# Altium schematic sheet HU_revC.SchDoc
size E; SheetNumber: 1; SheetTotal: 20
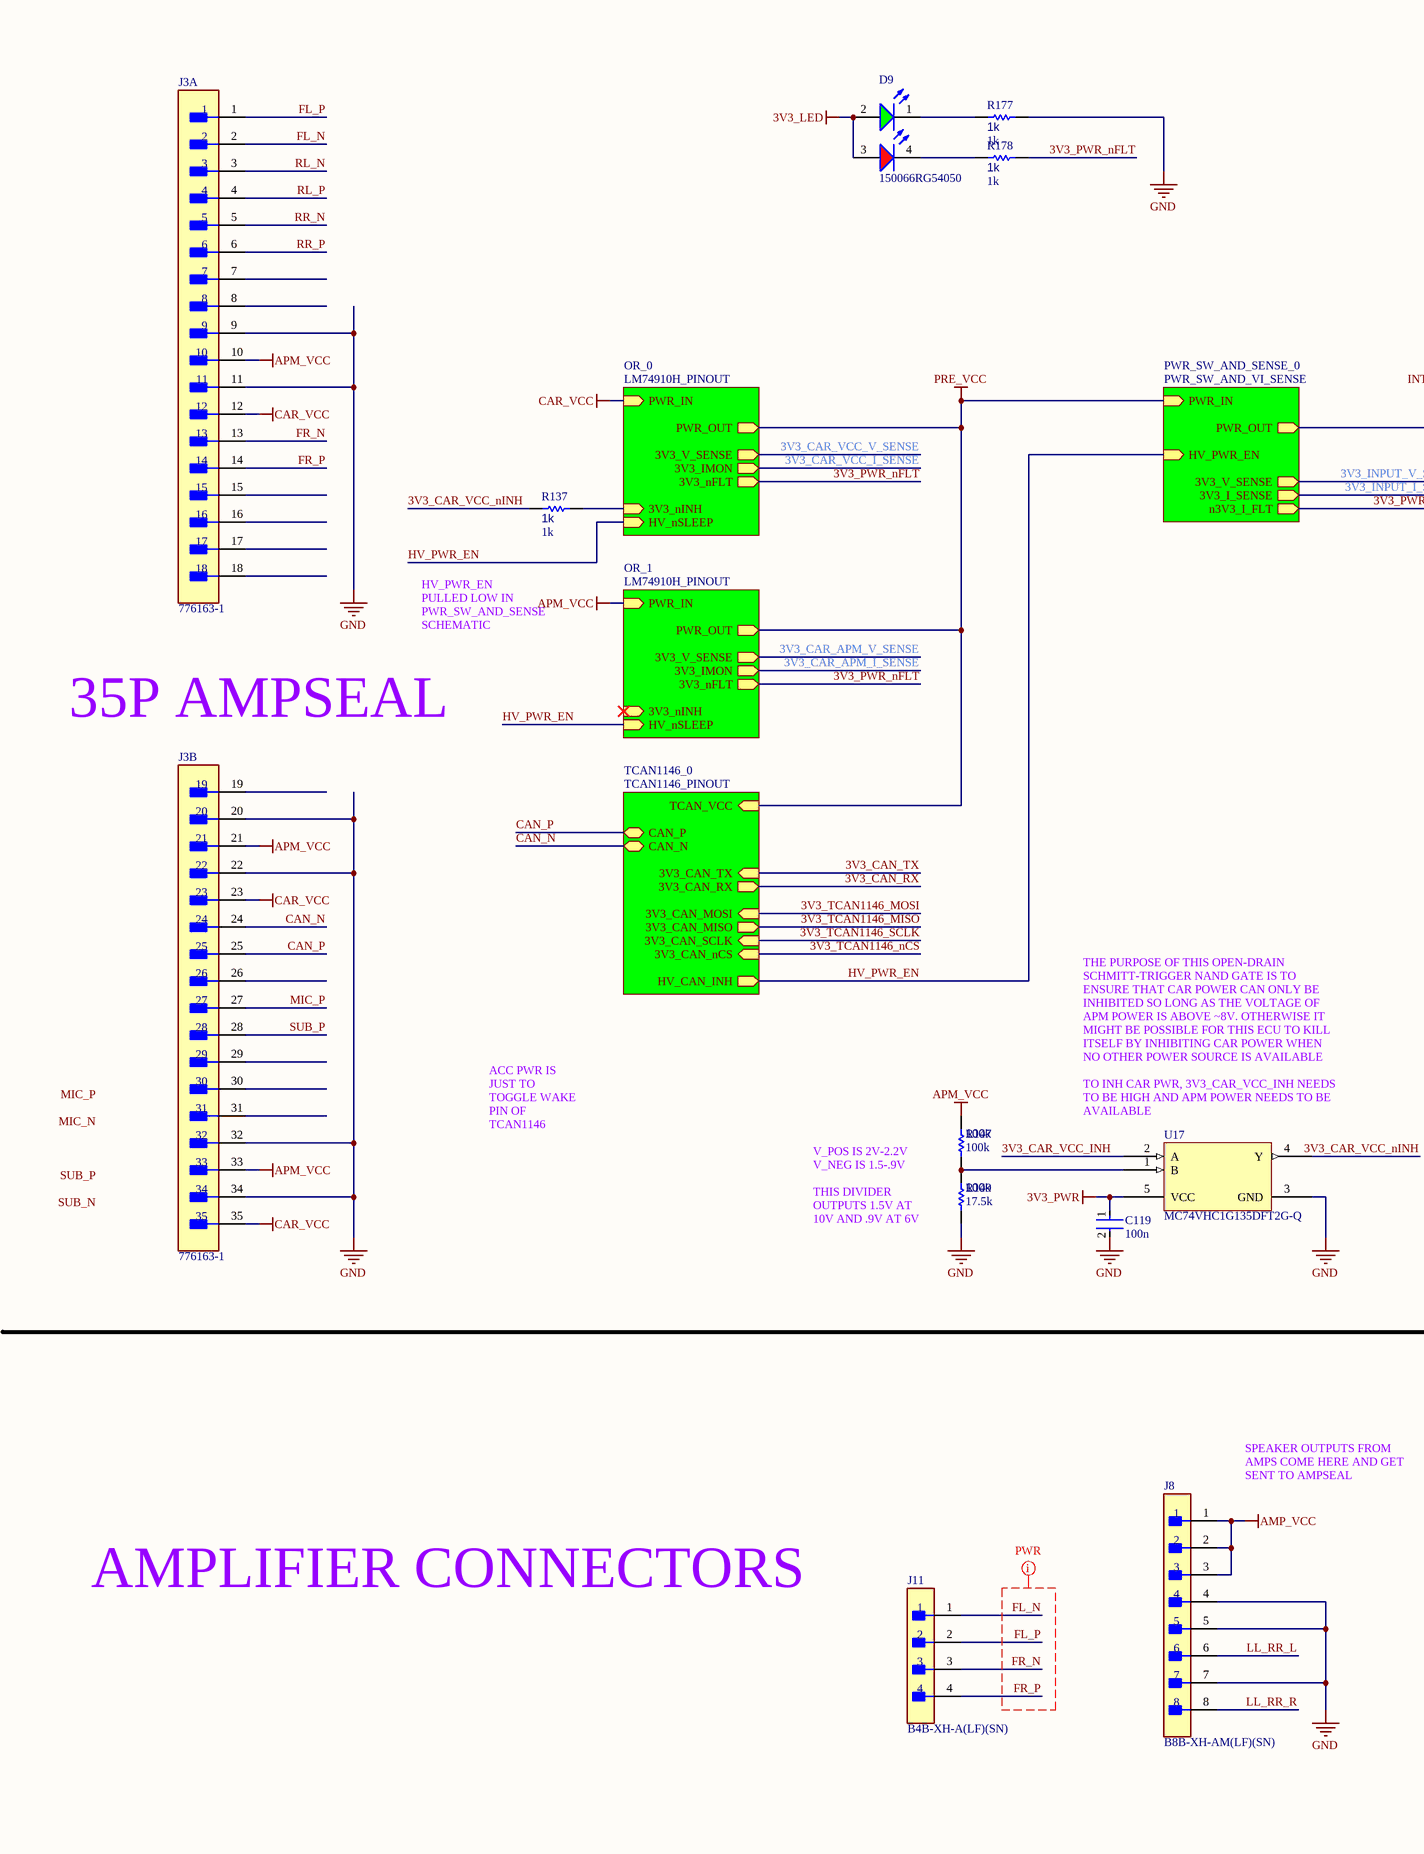
[diagram p0: HU_revC.SchDoc, top left]
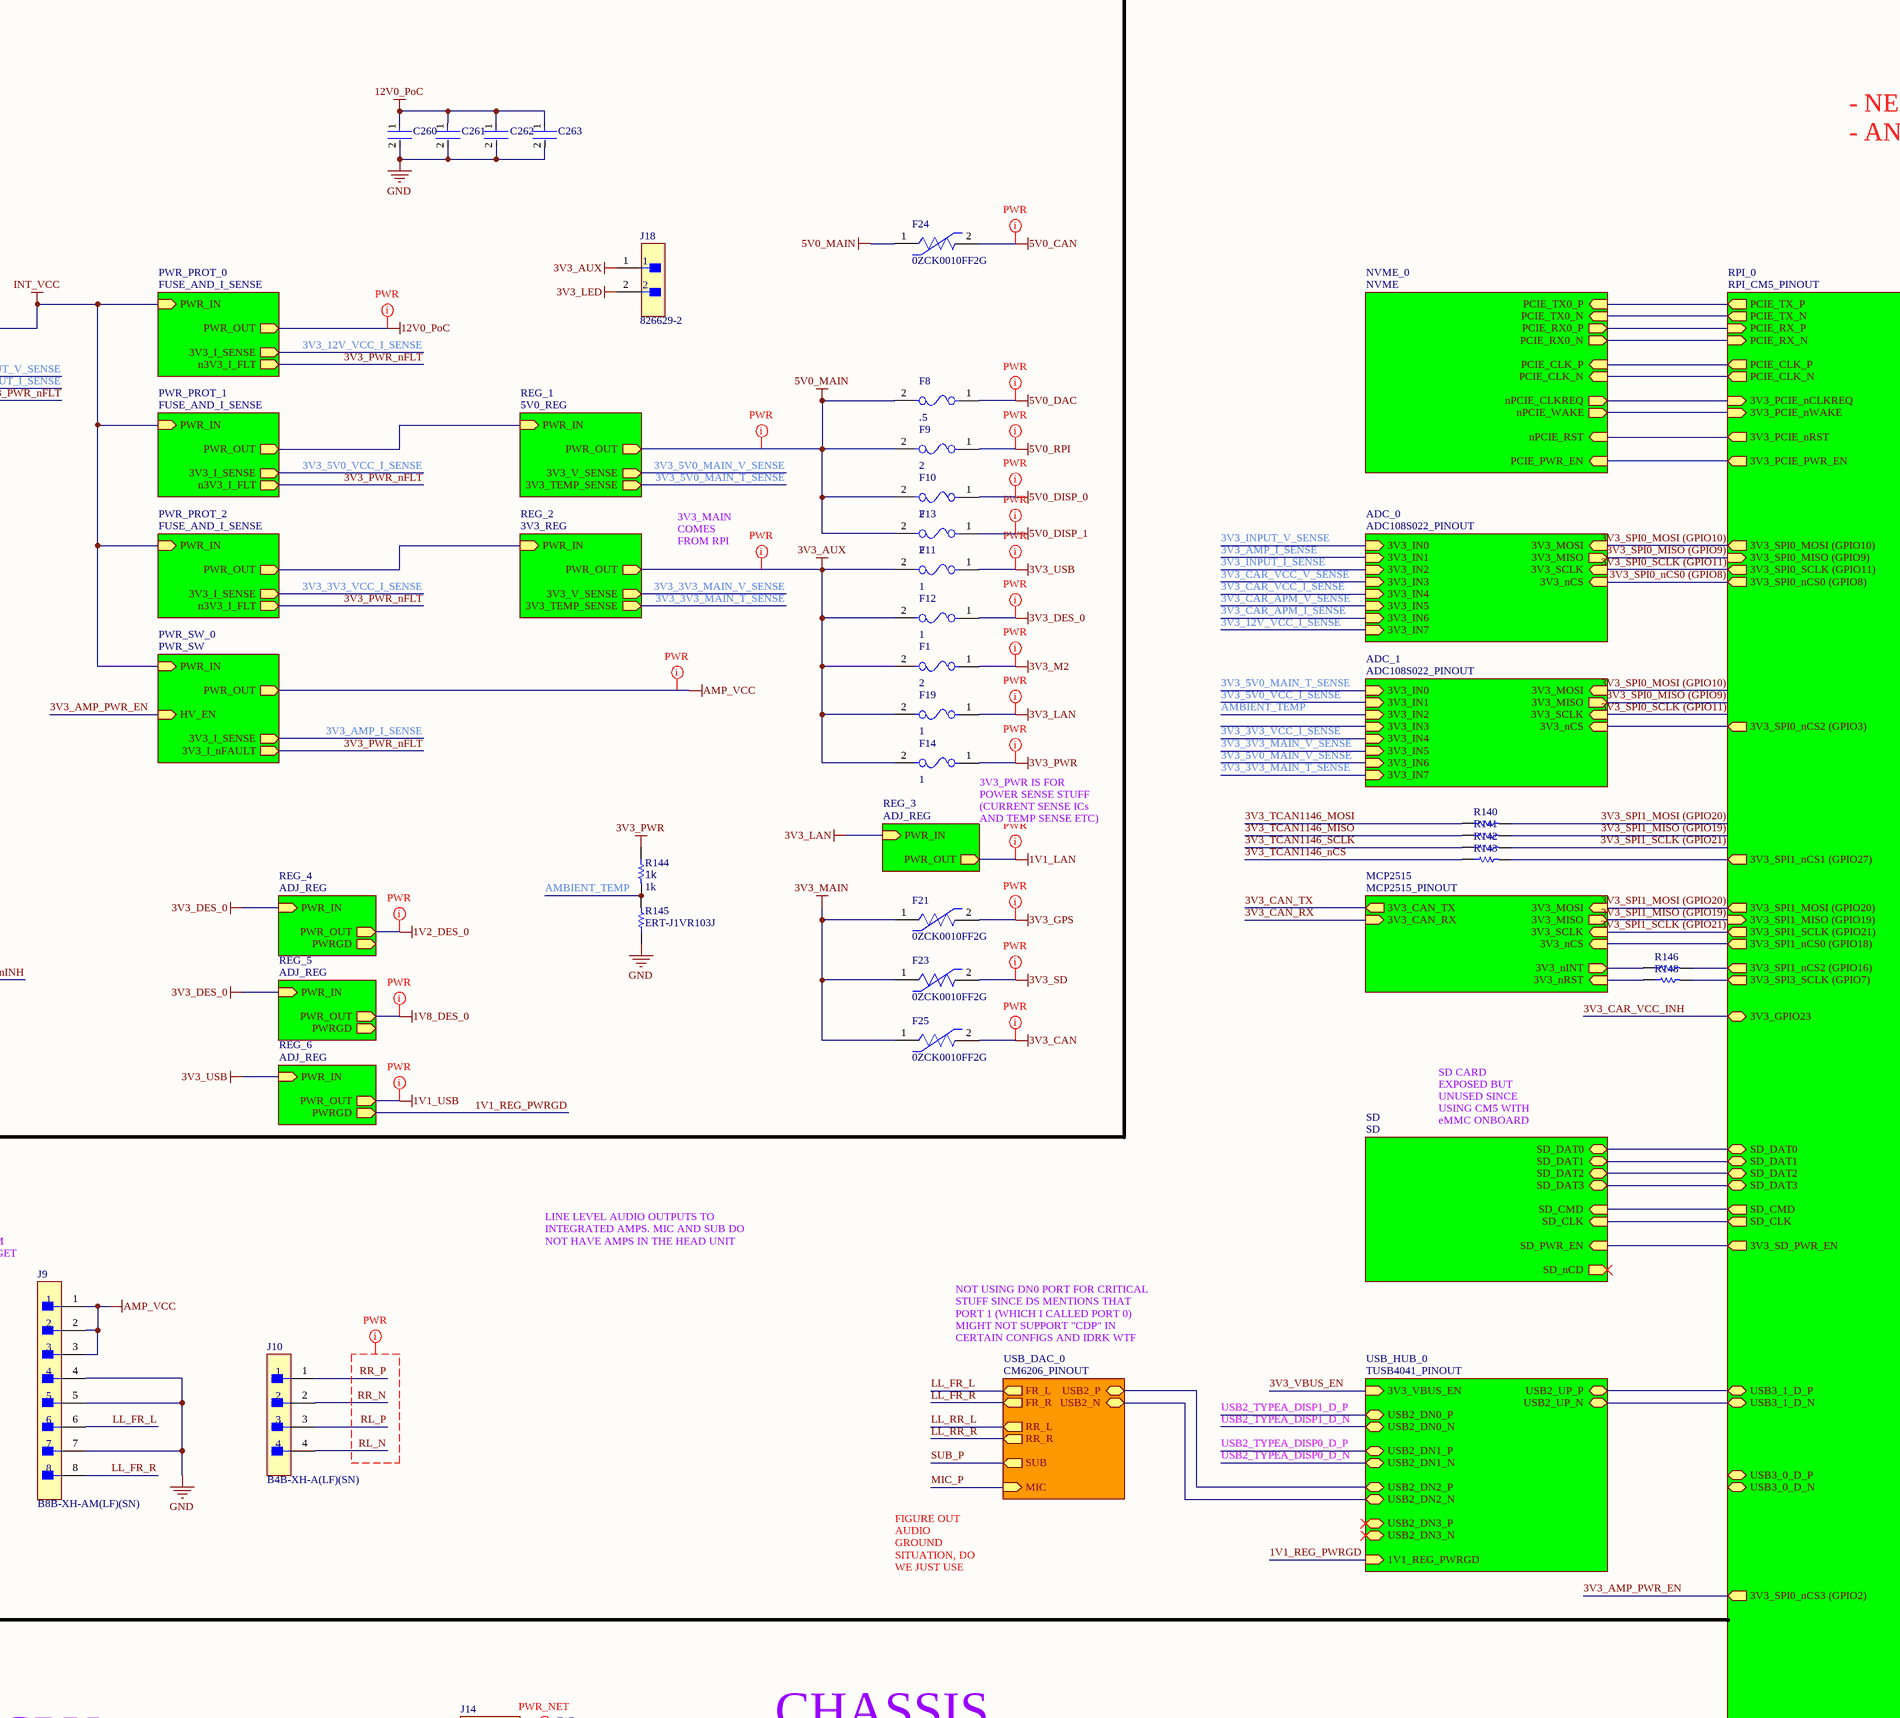
[diagram p1: HU_revC.SchDoc, top middle]
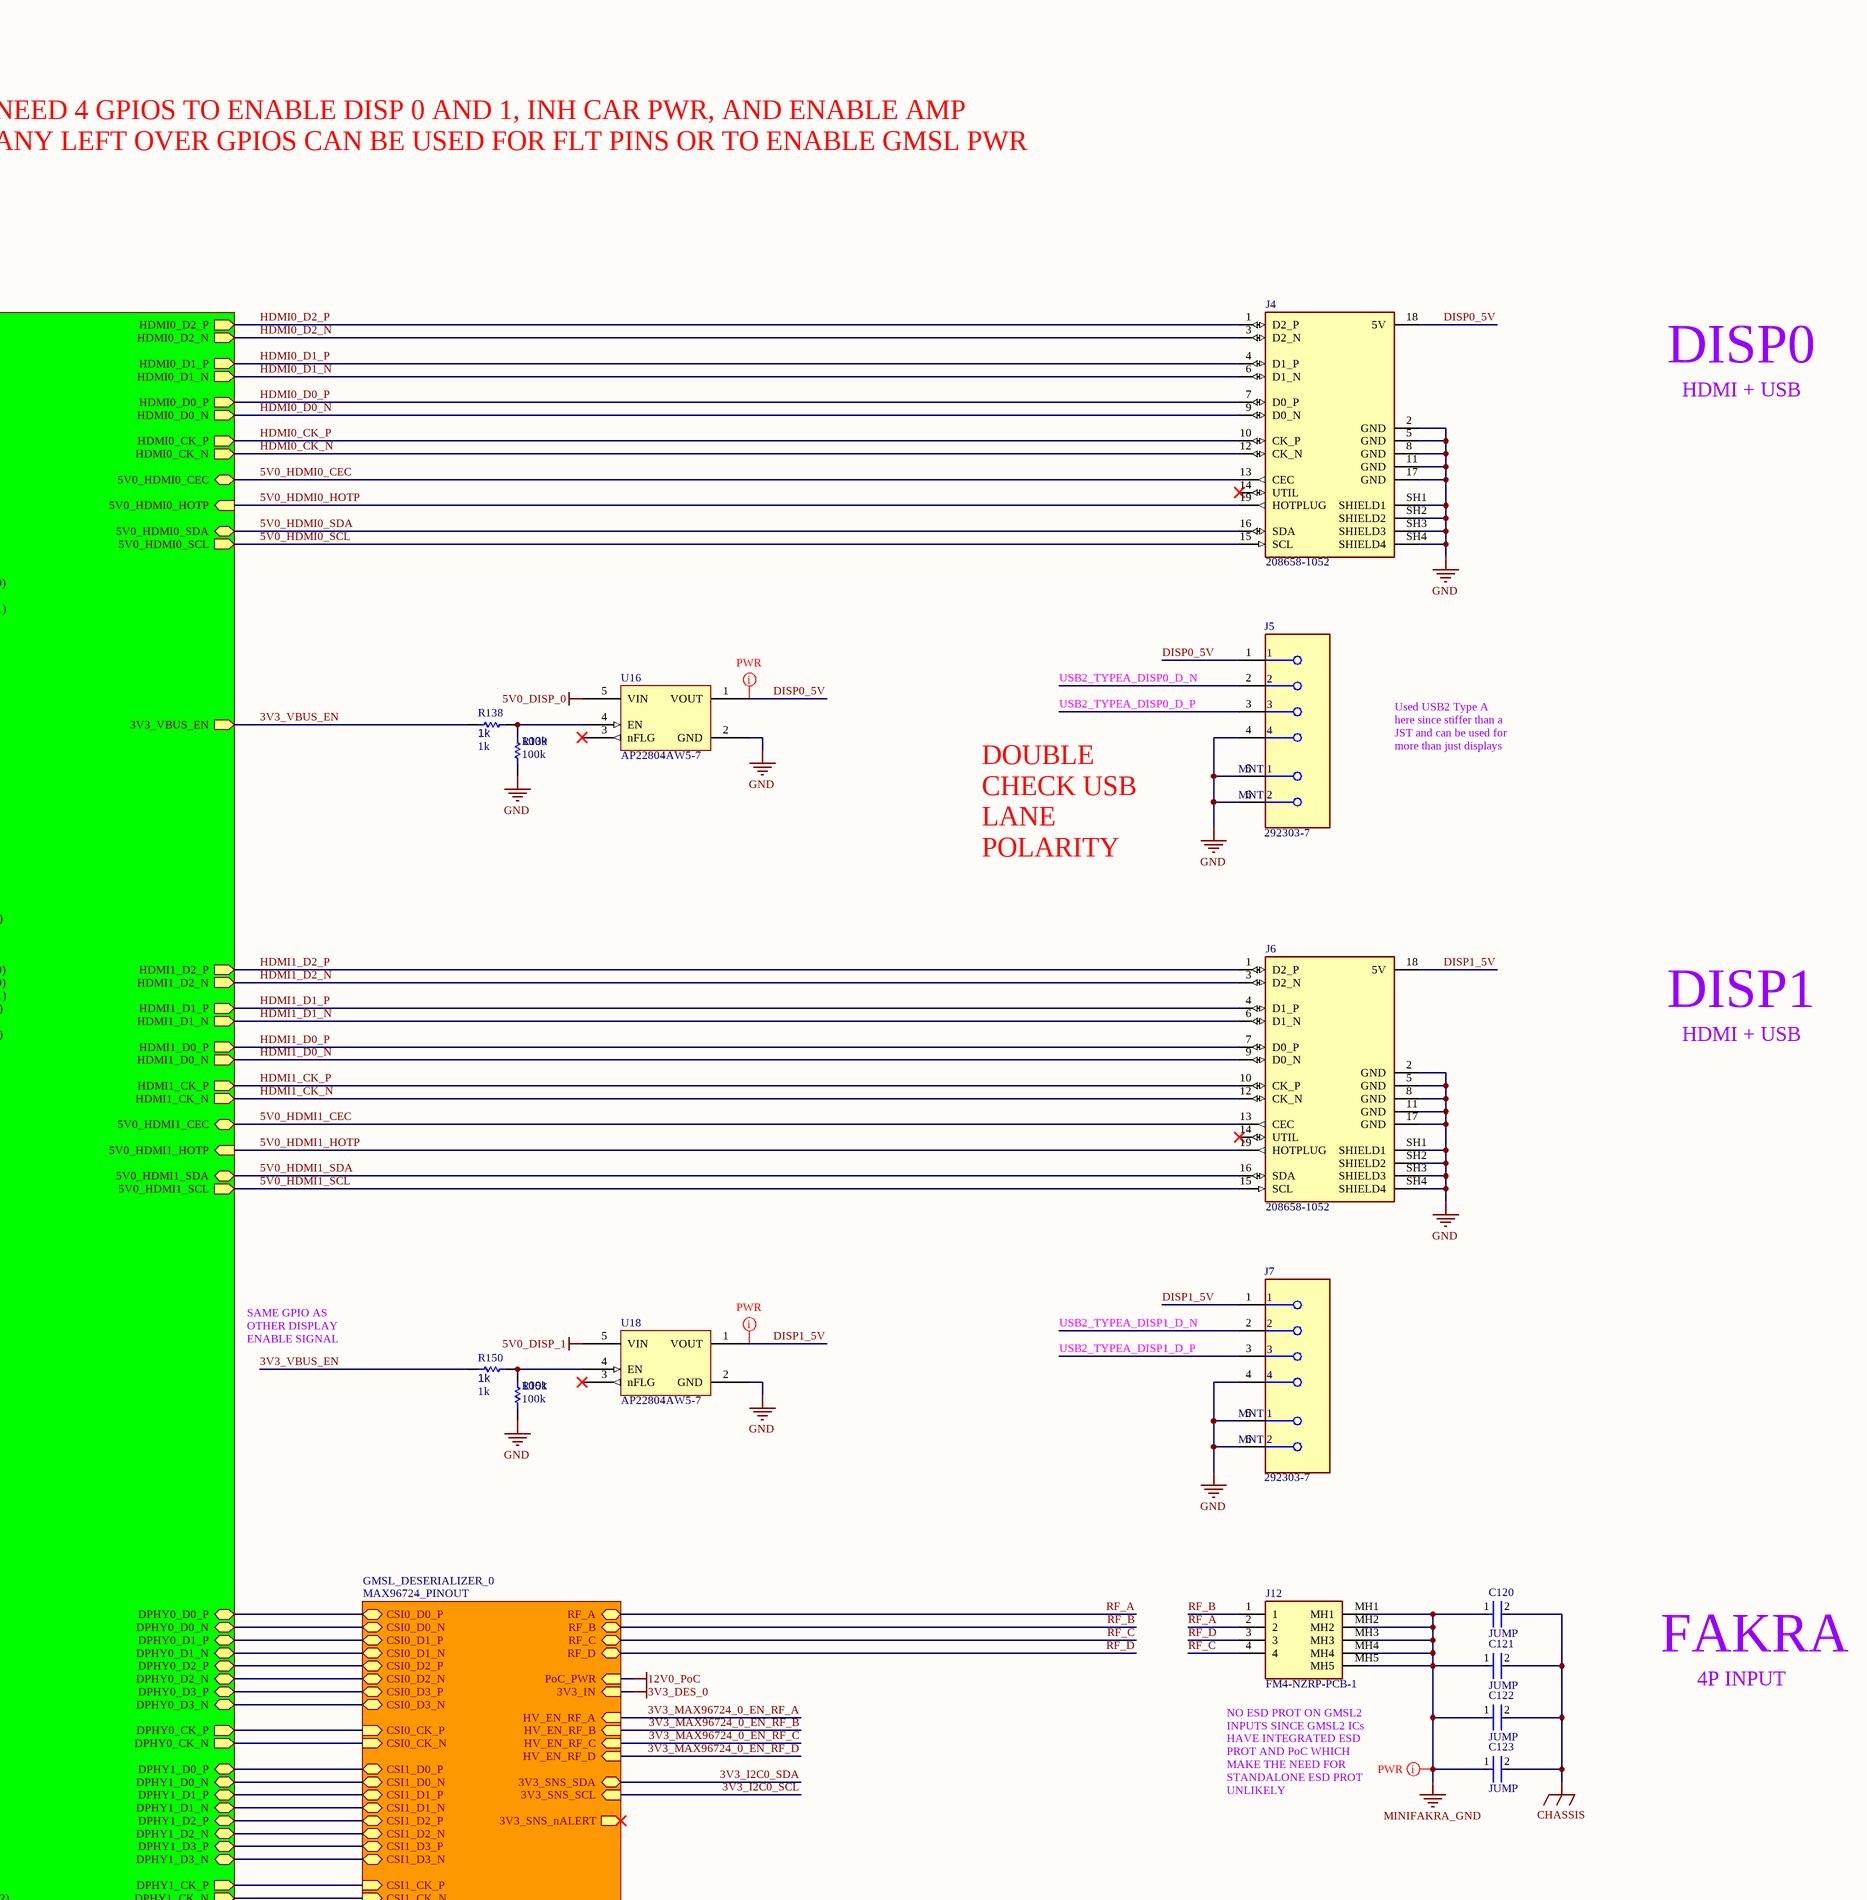
[diagram p2: HU_revC.SchDoc, top right]
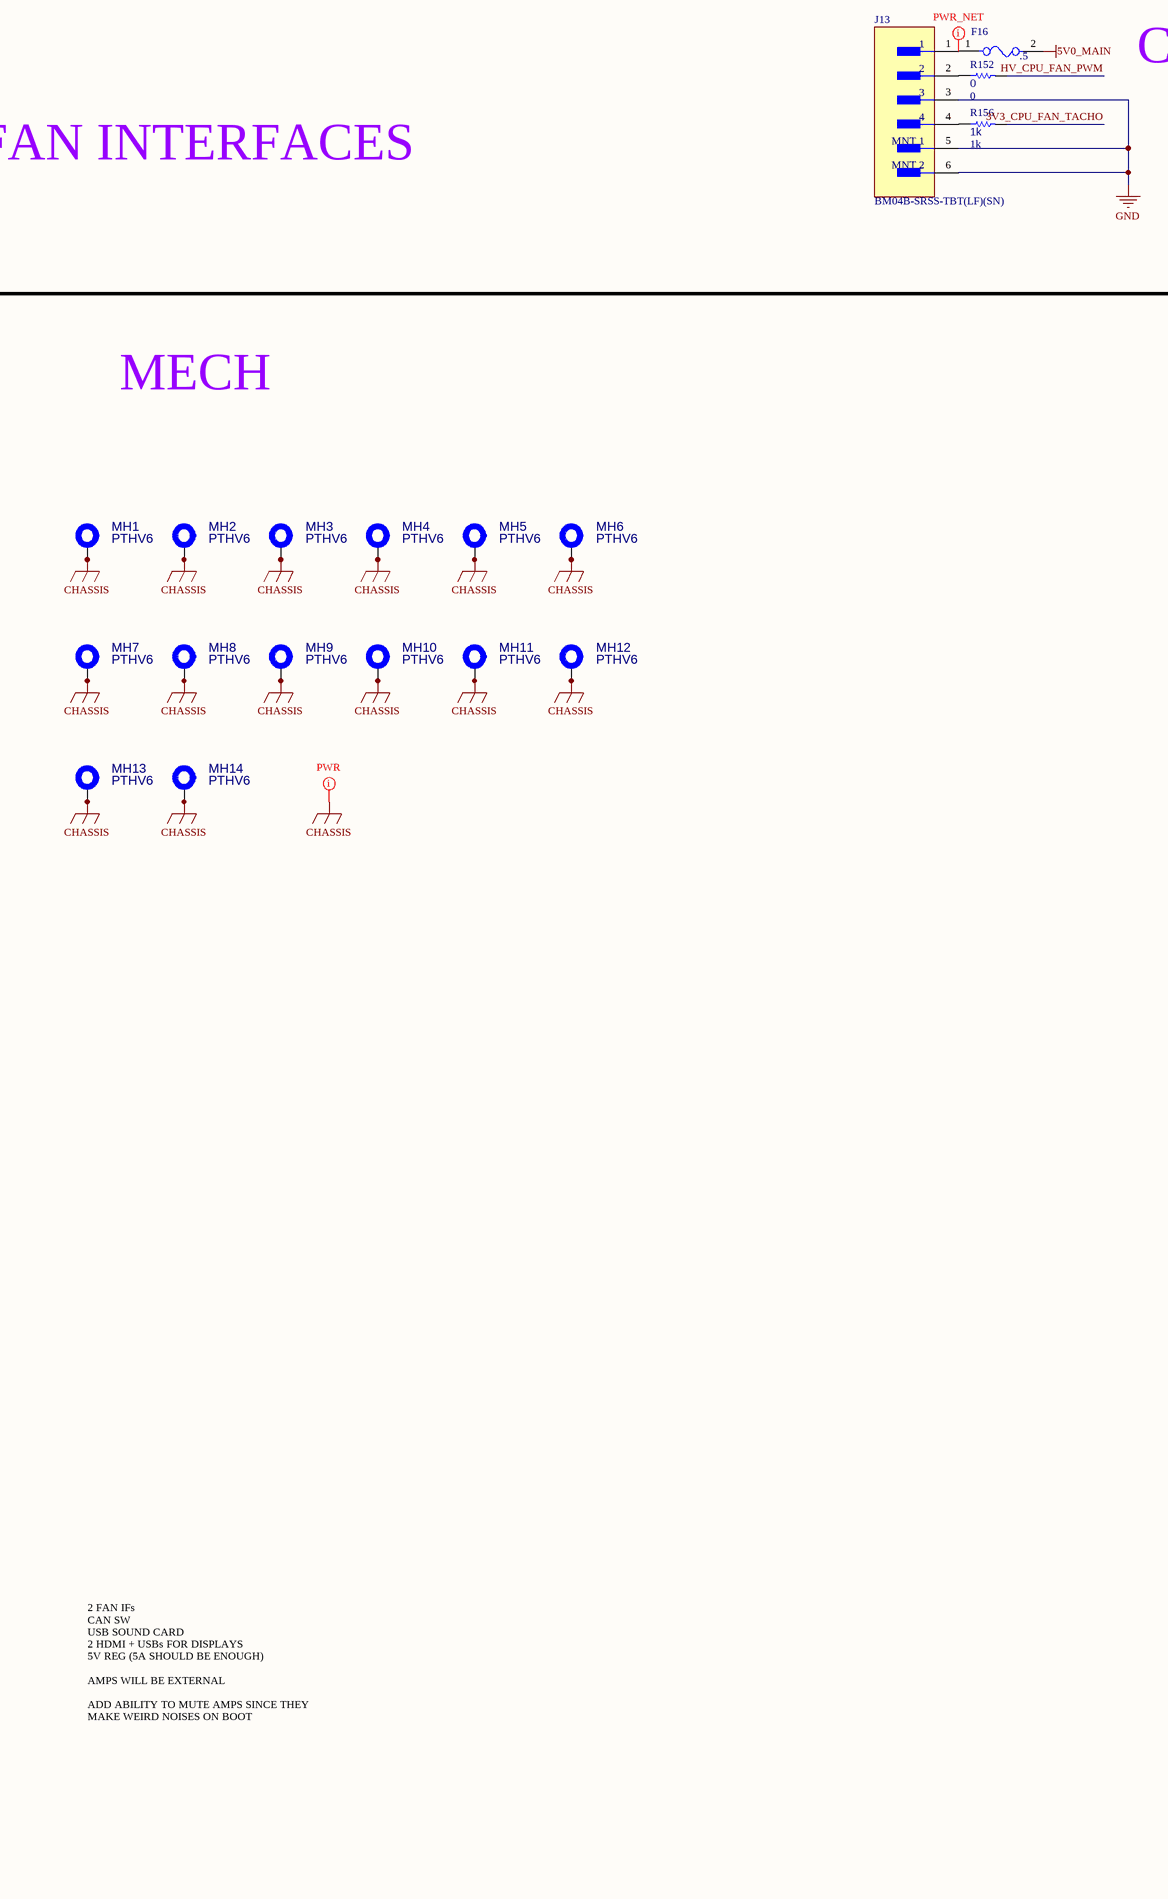
[diagram p3: HU_revC.SchDoc, bottom left]
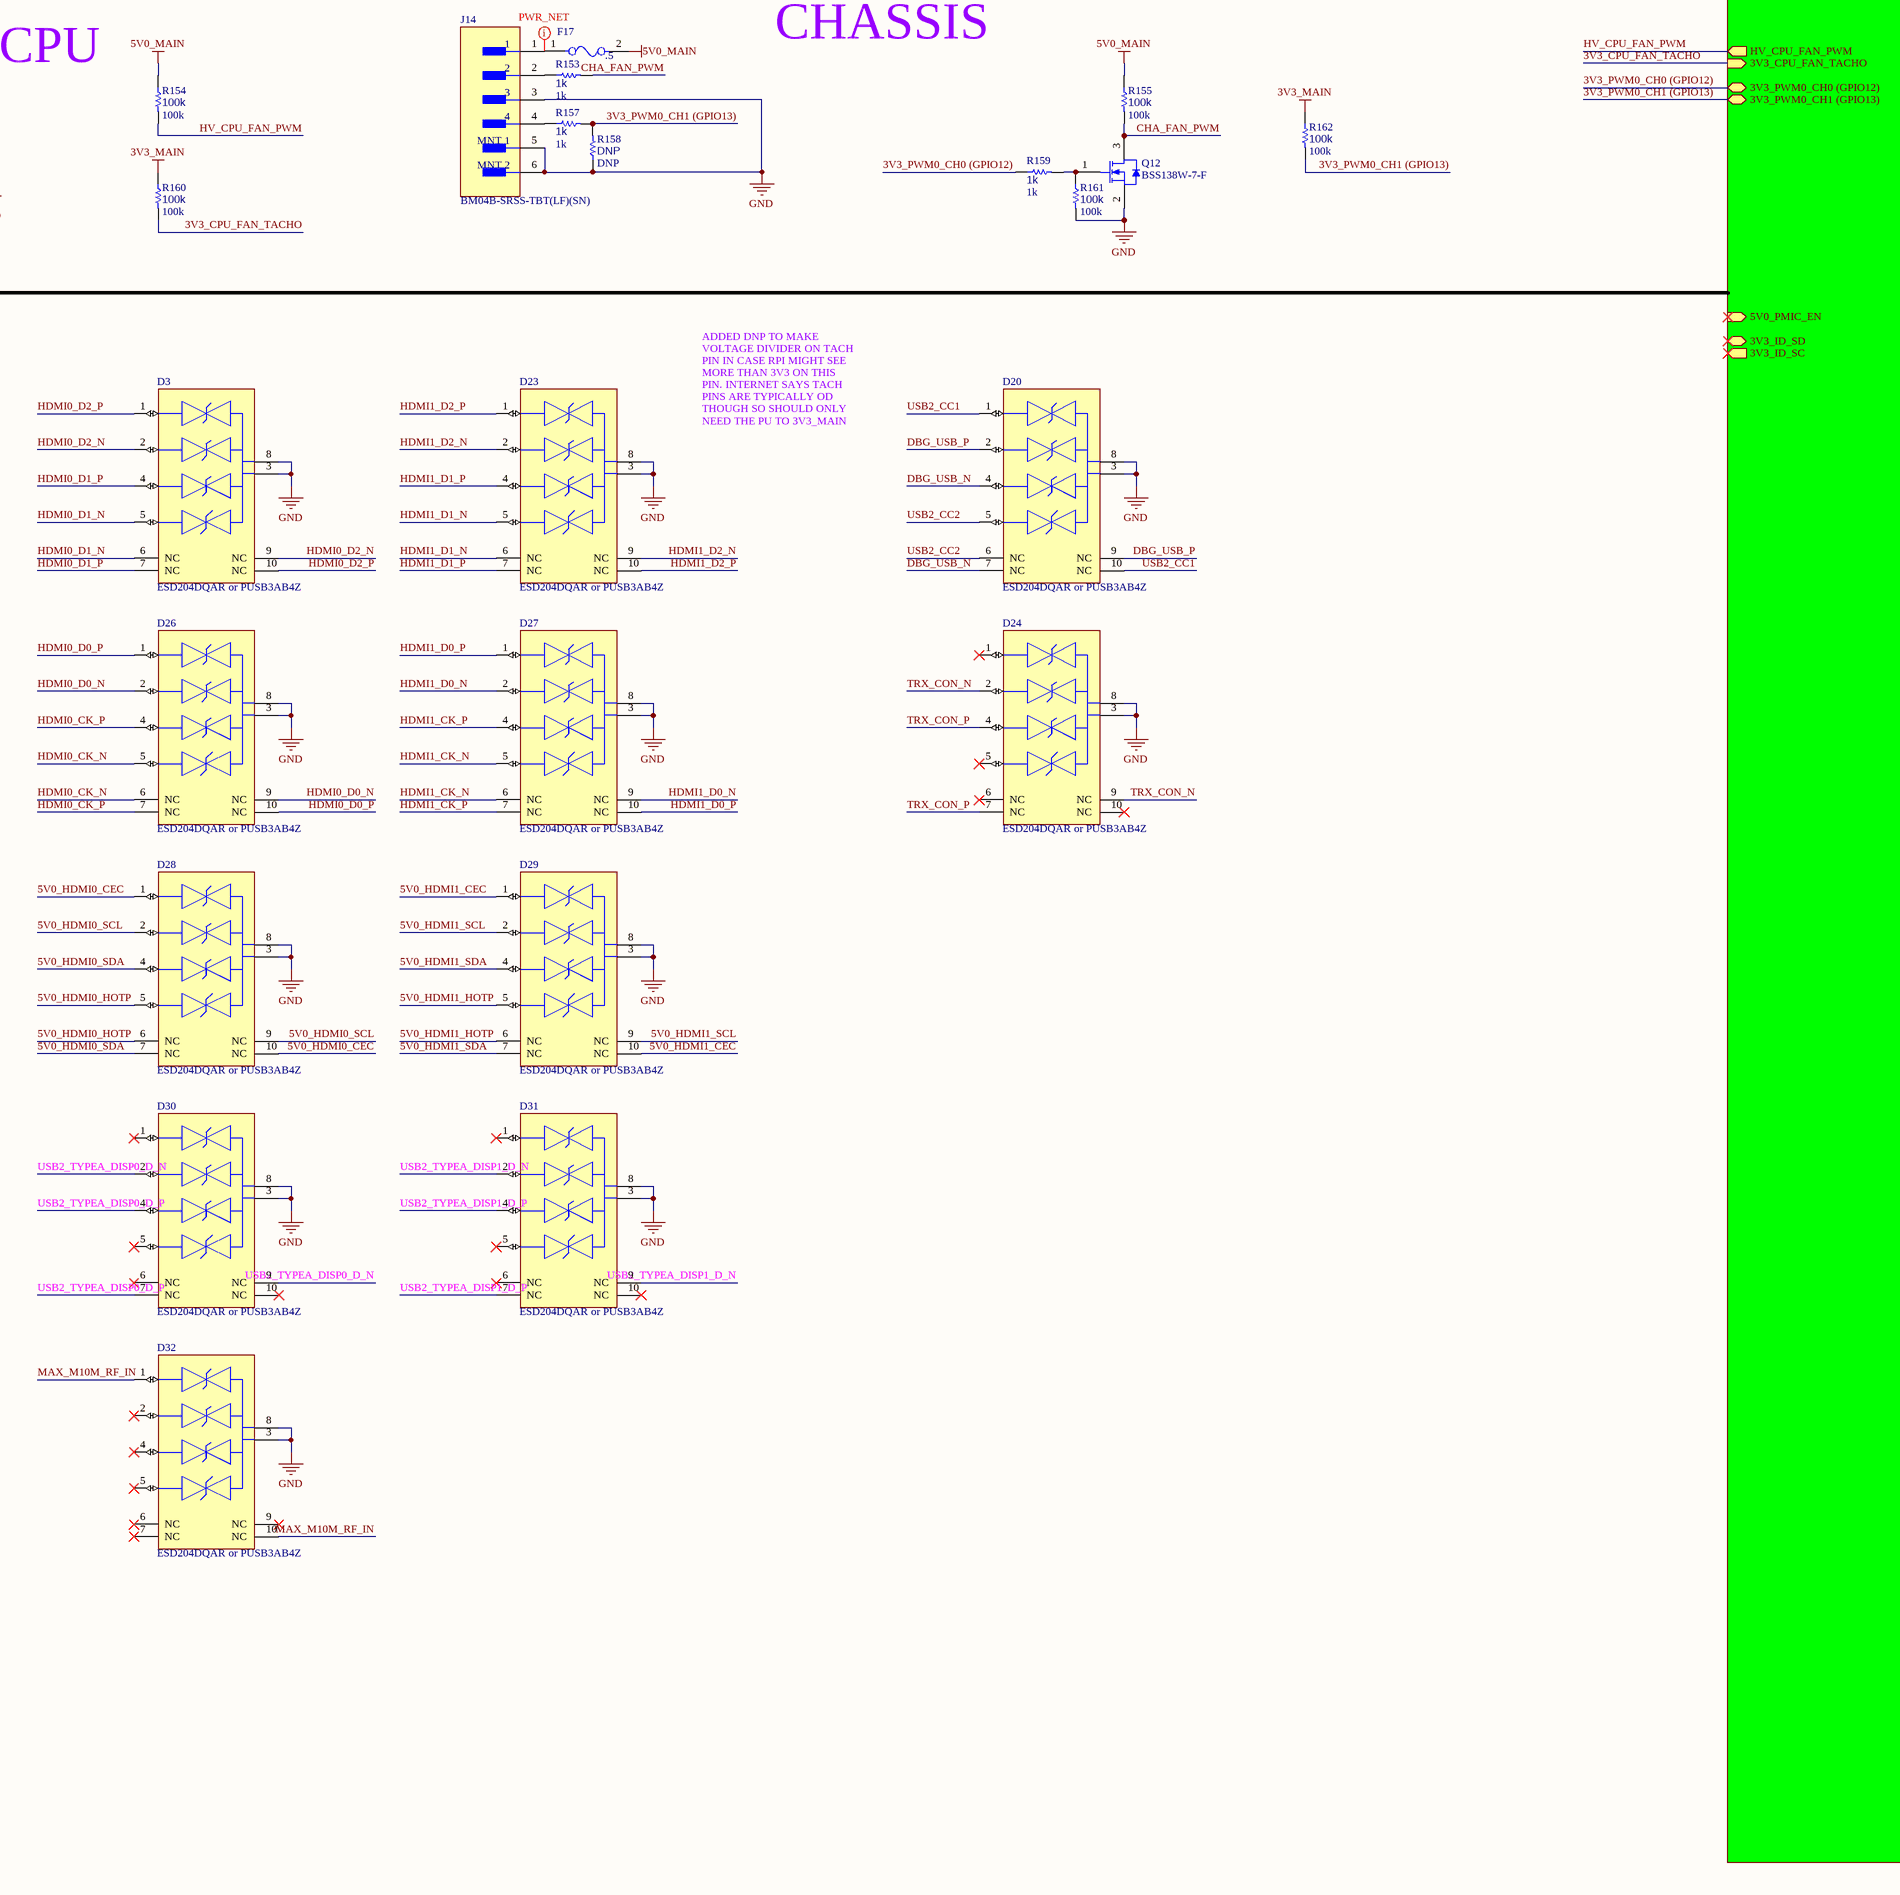
[diagram p4: HU_revC.SchDoc, bottom middle]
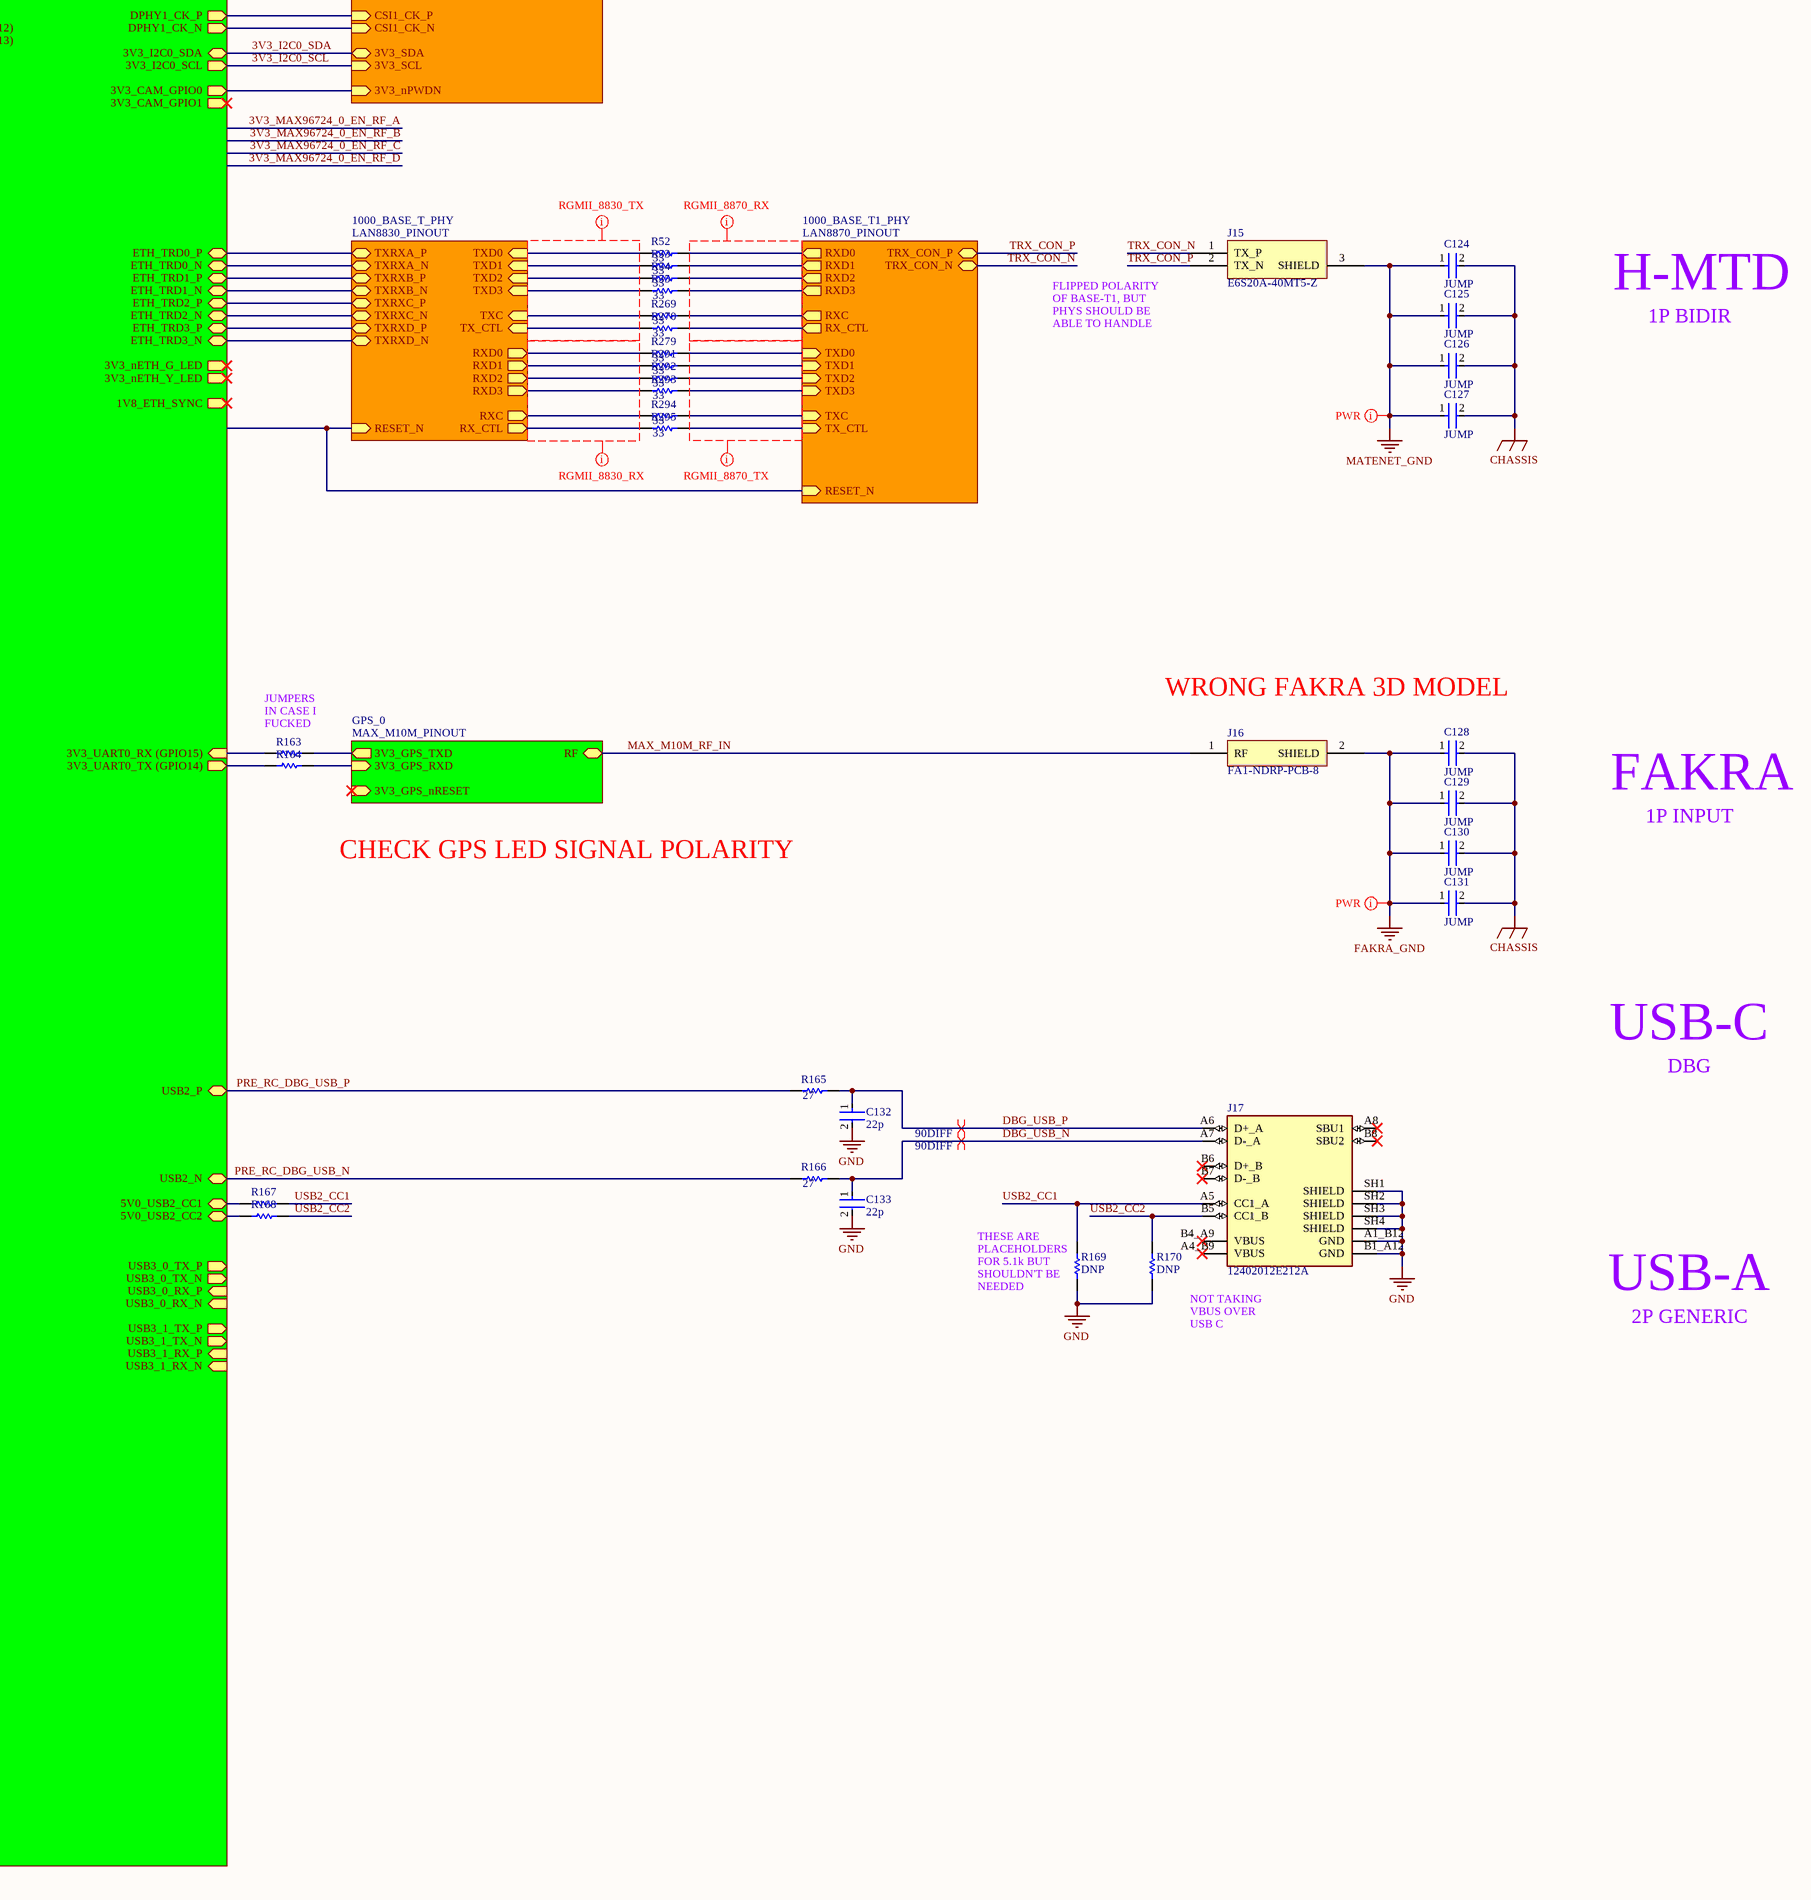
[diagram p5: HU_revC.SchDoc, bottom right]

## Parts
C119  100n  [FP-0402-L_1_0_0_05-W_0_5-IPC_A]
C120  JUMP  [FP-0402-L_1_0_0_05-W_0_5-IPC_A]
C121  JUMP  [FP-0402-L_1_0_0_05-W_0_5-IPC_A]
C122  JUMP  [FP-0402-L_1_0_0_05-W_0_5-IPC_A]
C123  JUMP  [FP-0402-L_1_0_0_05-W_0_5-IPC_A]
C124  JUMP  [FP-0402-L_1_0_0_05-W_0_5-IPC_A]
C125  JUMP  [FP-0402-L_1_0_0_05-W_0_5-IPC_A]
C126  JUMP  [FP-0402-L_1_0_0_05-W_0_5-IPC_A]
C127  JUMP  [FP-0402-L_1_0_0_05-W_0_5-IPC_A]
C128  JUMP  [FP-0402-L_1_0_0_05-W_0_5-IPC_A]
C129  JUMP  [FP-0402-L_1_0_0_05-W_0_5-IPC_A]
C130  JUMP  [FP-0402-L_1_0_0_05-W_0_5-IPC_A]
C131  JUMP  [FP-0402-L_1_0_0_05-W_0_5-IPC_A]
C132  22p  [FP-0402-L_1_0_0_05-W_0_5-IPC_A]
C133  22p  [FP-0402-L_1_0_0_05-W_0_5-IPC_A]
C260  GRM32ER61C476KE15L  [FP-GRM32E-0_3-0_2-IPC_C]  (value not drawn)
C261  GRM32ER61C476KE15L  [FP-GRM32E-0_3-0_2-IPC_C]  (value not drawn)
C262  GRM32ER61C476KE15L  [FP-GRM32E-0_3-0_2-IPC_C]  (value not drawn)
C263  GRM32ER61C476KE15L  [FP-GRM32E-0_3-0_2-IPC_C]  (value not drawn)
D3  ESD204DQAR or PUSB3AB4Z  [FP-DQA0010A-MFG]
D9  150066RG54050  [WL-SBCD_0606]
D20  ESD204DQAR or PUSB3AB4Z  [FP-DQA0010A-MFG]
D23  ESD204DQAR or PUSB3AB4Z  [FP-DQA0010A-MFG]
D24  ESD204DQAR or PUSB3AB4Z  [FP-DQA0010A-MFG]
D26  ESD204DQAR or PUSB3AB4Z  [FP-DQA0010A-MFG]
D27  ESD204DQAR or PUSB3AB4Z  [FP-DQA0010A-MFG]
D28  ESD204DQAR or PUSB3AB4Z  [FP-DQA0010A-MFG]
D29  ESD204DQAR or PUSB3AB4Z  [FP-DQA0010A-MFG]
D30  ESD204DQAR or PUSB3AB4Z  [FP-DQA0010A-MFG]
D31  ESD204DQAR or PUSB3AB4Z  [FP-DQA0010A-MFG]
D32  ESD204DQAR or PUSB3AB4Z  [FP-DQA0010A-MFG]
F1  2  [FP-0685T-MFG]
F8  .5  [FP-0685T-MFG]
F9  2  [FP-0685T-MFG]
F10  2  [FP-0685T-MFG]
F11  1  [FP-0685T-MFG]
F12  1  [FP-0685T-MFG]
F13  2  [FP-0685T-MFG]
F14  1  [FP-0685T-MFG]
F16  .5  [FP-0685T-MFG]
F17  .5  [FP-0685T-MFG]
F19  1  [FP-0685T-MFG]
F21  0ZCK0010FF2G  [FP-0ZCK0010FF2G-MFG]
F23  0ZCK0010FF2G  [FP-0ZCK0010FF2G-MFG]
F24  0ZCK0010FF2G  [FP-0ZCK0010FF2G-MFG]
F25  0ZCK0010FF2G  [FP-0ZCK0010FF2G-MFG]
J3  776163-1  [FP-776163-1-MFG]  (parts A,B of 2)
J4  208658-1052  [208658-1052-Footprint-1]
J5  292303-7  [FP-292303-7-MFG]
J6  208658-1052  [208658-1052-Footprint-1]
J7  292303-7  [FP-292303-7-MFG]
J8  B8B-XH-AM(LF)(SN)  [FP-B8B-XH-AM_LF_SN-MFG]
J9  B8B-XH-AM(LF)(SN)  [FP-B8B-XH-AM_LF_SN-MFG]
J10  B4B-XH-A(LF)(SN)  [FP-B4B-XH-A_LF_SN-MFG]
J11  B4B-XH-A(LF)(SN)  [FP-B4B-XH-A_LF_SN-MFG]
J12  FM4-NZRP-PCB-1  [FM4-NZRP-PCB-1-Footprint-1]
J13  BM04B-SRSS-TBT(LF)(SN)  [FP-BM04B-SRSS-TBT_LF_SN-MFG]
J14  BM04B-SRSS-TBT(LF)(SN)  [FP-BM04B-SRSS-TBT_LF_SN-MFG]
J15  E6S20A-40MT5-Z  [E6S20A-40MT5-Z-Footprint-1]
J16  FA1-NDRP-PCB-8  [FA1-NDRP-PCB-8-Footprint-1]
J17  12402012E212A  [12402012E212A-Footprint-1]
J18  826629-2  [FP-826629-2-MFG]
MH1  PTHV6  [PTHV6 M2]  (net tie, no BOM)
MH2  PTHV6  [PTHV6 M2]  (net tie, no BOM)
MH3  PTHV6  [PTHV6 M2]  (net tie, no BOM)
MH4  PTHV6  [PTHV6 M2]  (net tie, no BOM)
MH5  PTHV6  [PTHV6 M2]  (net tie, no BOM)
MH6  PTHV6  [PTHV6 M2]  (net tie, no BOM)
MH7  PTHV6  [PTHV6 M2]  (net tie, no BOM)
MH8  PTHV6  [PTHV6 M2]  (net tie, no BOM)
MH9  PTHV6  [PTHV6 M2]  (net tie, no BOM)
MH10  PTHV6  [PTHV6 M2]  (net tie, no BOM)
MH11  PTHV6  [PTHV6 M2]  (net tie, no BOM)
MH12  PTHV6  [PTHV6 M2]  (net tie, no BOM)
MH13  PTHV6  [PTHV6 M2]  (net tie, no BOM)
MH14  PTHV6  [PTHV6 M2]  (net tie, no BOM)
Q12  BSS138W-7-F  [DIOD-SOT323-3_V]
R52  33  [R0603B]
R53  33  [R0603B]
R54  33  [R0603B]
R55  33  [R0603B]
R137  1k  [R0603B]
R138  1k  [R0603B]
R139  100k  [R0603B]
R140  0402 JUMPER  [RESC1005X40X25ML05T05]  (value not drawn)
R141  0402 JUMPER  [RESC1005X40X25ML05T05]  (value not drawn)
R142  0402 JUMPER  [RESC1005X40X25ML05T05]  (value not drawn)
R143  0402 JUMPER  [RESC1005X40X25ML05T05]  (value not drawn)
R144  1k  [R0603B]
R145  ERT-J1VR103J  [RESC1608X90X30ML15T20]
R146  0402 JUMPER  [RESC1005X40X25ML05T05]  (value not drawn)
R147  100k  [R0603B]
R148  0402 JUMPER  [RESC1005X40X25ML05T05]  (value not drawn)
R149  17.5k  value 100k  [R0603B]
R150  1k  [R0603B]
R151  100k  [R0603B]
R152  0  [R0603B]
R153  1k  [R0603B]
R154  100k  [R0603B]
R155  100k  [R0603B]
R156  1k  [R0603B]
R157  1k  [R0603B]
R158  DNP  [R0603B]
R159  1k  [R0603B]
R160  100k  [R0603B]
R161  100k  [R0603B]
R162  100k  [R0603B]
R163  0402 JUMPER  [RESC1005X40X25ML05T05]  (value not drawn)
R164  0402 JUMPER  [RESC1005X40X25ML05T05]  (value not drawn)
R165  27  [R0603B]
R166  27  [R0603B]
R167  0402 JUMPER  [RESC1005X40X25ML05T05]  (value not drawn)
R168  0402 JUMPER  [RESC1005X40X25ML05T05]  (value not drawn)
R169  DNP  [R0603B]
R170  DNP  [R0603B]
R177  1k  [R0603B]
R178  1k  [R0603B]
R269  33  [R0603B]
R270  33  [R0603B]
R279  33  [R0603B]
R291  33  [R0603B]
R292  33  [R0603B]
R293  33  [R0603B]
R294  33  [R0603B]
R295  33  [R0603B]
U16  AP22804AW5-7  [SOT95P285X140-5N]
U17  MC74VHC1G135DFT2G-Q  [SOT65P210X110-5N]
U18  AP22804AW5-7  [SOT95P285X140-5N]

## Sub-sheets
1000_BASE_T1_PHY = LAN8870_PINOUT: RXD0 (out), RXD1 (out), RXD2 (out), RXD3 (out), RXC (out), RX_CTL (out), TXD0 (in), TXD1 (in), TXD2 (in), TXD3 (in), TXC (in), TX_CTL (in), TRX_CON_P (bidir), TRX_CON_N (bidir), RESET_N (in)
1000_BASE_T_PHY = LAN8830_PINOUT: TXD0 (in), TXD1 (in), TXD2 (in), TXD3 (in), TXC (in), TX_CTL (in), RXD0 (out), RXD1 (out), RXD2 (out), RXD3 (out), RXC (out), RX_CTL (out), TXRXA_P (bidir), TXRXA_N (bidir), RESET_N (in), TXRXB_P (bidir), TXRXB_N (bidir), TXRXC_P (bidir), TXRXC_N (bidir), TXRXD_P (bidir), TXRXD_N (bidir)
ADC_0 = ADC108S022_PINOUT: 3V3_MOSI (in), 3V3_MISO (out), 3V3_SCLK (in), 3V3_nCS (in), 3V3_IN0 (in), 3V3_IN1 (in), 3V3_IN2 (in), 3V3_IN3 (in), 3V3_IN4 (in), 3V3_IN5 (in), 3V3_IN6 (in), 3V3_IN7 (in)
ADC_1 = ADC108S022_PINOUT: 3V3_MOSI (in), 3V3_MISO (out), 3V3_SCLK (in), 3V3_nCS (in), 3V3_IN0 (in), 3V3_IN1 (in), 3V3_IN2 (in), 3V3_IN3 (in), 3V3_IN4 (in), 3V3_IN5 (in), 3V3_IN6 (in), 3V3_IN7 (in)
GMSL_DESERIALIZER_0 = MAX96724_PINOUT: CSI0_D0_P (bidir), CSI0_D0_N (bidir), CSI0_D1_P (bidir), CSI0_D1_N (bidir), CSI0_D2_P (bidir), CSI0_D2_N (bidir), CSI0_D3_P (bidir), CSI0_D3_N (bidir), CSI0_CK_P (in), CSI0_CK_N (in), CSI1_D0_P (bidir), CSI1_D0_N (bidir), CSI1_D1_P (bidir), CSI1_D1_N (bidir), CSI1_D2_P (bidir), CSI1_D2_N (bidir), CSI1_D3_P (bidir), CSI1_D3_N (bidir), CSI1_CK_P (in), CSI1_CK_N (in), RF_B (bidir), RF_A (bidir), RF_C (bidir), RF_D (bidir), 3V3_nPWDN (in), PoC_PWR (in), 3V3_SDA (bidir), 3V3_SCL (in), 3V3_IN (in), 3V3_SNS_SDA (bidir), 3V3_SNS_SCL (in), 3V3_SNS_nALERT (out), HV_EN_RF_A (in), HV_EN_RF_B (in), HV_EN_RF_C (in), HV_EN_RF_D (in)
GPS_0 = MAX_M10M_PINOUT: 3V3_GPS_TXD (out), 3V3_GPS_RXD (in), 3V3_GPS_nRESET (in), RF (bidir)
MCP2515 = MCP2515_PINOUT: 3V3_MOSI (in), 3V3_MISO (out), 3V3_SCLK (in), 3V3_nCS (in), 3V3_nINT (out), 3V3_nRST (in), 3V3_CAN_RX (in), 3V3_CAN_TX (out)
NVME_0 = NVME: nPCIE_RST (in), nPCIE_CLKREQ (out), nPCIE_WAKE (out), PCIE_PWR_EN (in), PCIE_TX0_N (in), PCIE_TX0_P (in), PCIE_RX0_N (out), PCIE_RX0_P (out), PCIE_CLK_N (in), PCIE_CLK_P (in)
OR_0 = LM74910H_PINOUT: PWR_IN (in), PWR_OUT (out), 3V3_nFLT (out), HV_nSLEEP (in), 3V3_IMON (out), 3V3_V_SENSE (out), 3V3_nINH (in)
OR_1 = LM74910H_PINOUT: PWR_IN (in), PWR_OUT (out), 3V3_nFLT (out), HV_nSLEEP (in), 3V3_IMON (out), 3V3_V_SENSE (out), 3V3_nINH (in)
PWR_PROT_0 = FUSE_AND_I_SENSE: PWR_IN (in), PWR_OUT (out), 3V3_I_SENSE (out), n3V3_I_FLT (out)
PWR_PROT_1 = FUSE_AND_I_SENSE: PWR_IN (in), PWR_OUT (out), 3V3_I_SENSE (out), n3V3_I_FLT (out)
PWR_PROT_2 = FUSE_AND_I_SENSE: PWR_IN (in), PWR_OUT (out), 3V3_I_SENSE (out), n3V3_I_FLT (out)
PWR_SW_0 = PWR_SW: PWR_IN (in), PWR_OUT (out), HV_EN (in), 3V3_I_SENSE (out), 3V3_I_nFAULT (out)
PWR_SW_AND_SENSE_0 = PWR_SW_AND_VI_SENSE: PWR_IN (in), PWR_OUT (out), 3V3_I_SENSE (out), n3V3_I_FLT (out), HV_PWR_EN (in), 3V3_V_SENSE (out)
REG_1 = 5V0_REG: PWR_IN (in), PWR_OUT (out), 3V3_V_SENSE (out), 3V3_TEMP_SENSE (out)
REG_2 = 3V3_REG: PWR_IN (in), PWR_OUT (out), 3V3_V_SENSE (out), 3V3_TEMP_SENSE (out)
REG_3 = ADJ_REG: PWR_OUT (out), PWR_IN (in)
REG_4 = ADJ_REG: PWR_OUT (out), PWR_IN (in), PWRGD (out)
REG_5 = ADJ_REG: PWR_OUT (out), PWR_IN (in), PWRGD (out)
REG_6 = ADJ_REG: PWR_OUT (out), PWR_IN (in), PWRGD (out)
RPI_0 = RPI_CM5_PINOUT: 3V3_PCIE_nCLKREQ (in), 3V3_PCIE_nWAKE (in), 3V3_PCIE_PWR_EN (out), PCIE_CLK_P (out), PCIE_CLK_N (out), PCIE_RX_P (in), PCIE_RX_N (in), PCIE_TX_P (out), PCIE_TX_N (out), 3V3_PCIE_nRST (out), 5V0_HDMI1_HOTP (in), 5V0_HDMI1_SDA (bidir), 5V0_HDMI1_SCL (out), 5V0_HDMI1_CEC (bidir), 5V0_HDMI0_CEC (bidir), 5V0_HDMI0_HOTP (in), 5V0_HDMI0_SDA (bidir), HDMI1_D2_P (out), HDMI1_D2_N (out), HDMI1_D1_P (out), HDMI1_D1_N (out), HDMI1_D0_P (out), HDMI1_D0_N (out), HDMI1_CK_P (out), HDMI1_CK_N (out), HDMI0_D2_P (out), HDMI0_D2_N (out), HDMI0_D1_P (out), HDMI0_D1_N (out), HDMI0_D0_P (out), HDMI0_D0_N (out), HDMI0_CK_P (out), HDMI0_CK_N (out), 5V0_HDMI0_SCL (out), DPHY0_D0_N (bidir), DPHY0_D0_P (bidir), DPHY0_D1_N (bidir), DPHY0_D1_P (bidir), DPHY0_CK_N (out), DPHY0_CK_P (out), DPHY0_D2_N (bidir), DPHY0_D2_P (bidir), DPHY0_D3_N (bidir), DPHY0_D3_P (bidir), DPHY1_D0_N (bidir), DPHY1_D0_P (bidir), DPHY1_D1_N (bidir), DPHY1_D1_P (bidir), DPHY1_CK_N (out), DPHY1_CK_P (out), DPHY1_D2_N (bidir), DPHY1_D2_P (bidir), DPHY1_D3_N (bidir), DPHY1_D3_P (bidir), ETH_TRD3_P (bidir), ETH_TRD3_N (bidir), ETH_TRD2_N (bidir), ETH_TRD2_P (bidir), ETH_TRD1_P (bidir), ETH_TRD1_N (bidir), ETH_TRD0_N (bidir), ETH_TRD0_P (bidir), 3V3_nETH_Y_LED (out), 3V3_nETH_G_LED (out), 3V3_CAM_GPIO0 (out), 3V3_CAM_GPIO1 (out), 3V3_I2C0_SCL (out), 3V3_I2C0_SDA (bidir), SD_CLK (out), SD_DAT3 (bidir), SD_DAT0 (bidir), SD_DAT1 (bidir), SD_DAT2 (bidir), 3V3_SD_PWR_EN (out), SD_CMD (out), 3V3_SPI0_nCS2 (GPIO3) (out), 3V3_UART0_RX (GPIO15) (in), 3V3_UART0_TX (GPIO14) (out), 5V0_USB2_CC1 (bidir), 5V0_USB2_CC2 (bidir), USB2_N (bidir), USB2_P (bidir), HV_CPU_FAN_PWM (out), 3V3_CPU_FAN_TACHO (in), 3V3_PWM0_CH0 (GPIO12) (bidir), 3V3_PWM0_CH1 (GPIO13) (bidir), 3V3_ID_SC (out), 3V3_ID_SD (bidir), 5V0_PMIC_EN (in), 1V8_ETH_SYNC (out), USB3_0_D_P (bidir), USB3_0_D_N (bidir), USB3_1_D_P (bidir), USB3_1_D_N (bidir), USB3_0_RX_N (in), USB3_0_RX_P (in), USB3_0_TX_N (out), USB3_0_TX_P (out), USB3_1_RX_N (in), USB3_1_RX_P (in), USB3_1_TX_N (out), USB3_1_TX_P (out), 3V3_VBUS_EN (out), 3V3_SPI0_nCS0 (GPIO8) (out), 3V3_SPI0_SCLK (GPIO11) (out), 3V3_SPI0_MISO (GPIO9) (in), 3V3_SPI0_MOSI (GPIO10) (out), 3V3_SPI1_MOSI (GPIO20) (out), 3V3_SPI1_MISO (GPIO19) (in), 3V3_SPI1_SCLK (GPIO21) (out), 3V3_SPI1_nCS0 (GPIO18) (out), 3V3_SPI1_nCS1 (GPIO27) (out), 3V3_SPI3_SCLK (GPIO7) (out), 3V3_SPI1_nCS2 (GPIO16) (out), 3V3_GPIO23 (bidir), 3V3_SPI0_nCS3 (GPIO2) (out)
SD = SD: SD_DAT0 (bidir), SD_DAT1 (bidir), SD_DAT2 (bidir), SD_DAT3 (bidir), SD_CMD (in), SD_CLK (in), SD_PWR_EN (in), SD_nCD (out)
TCAN1146_0 = TCAN1146_PINOUT: CAN_P (bidir), CAN_N (bidir), HV_CAN_INH (out), TCAN_VCC (in), 3V3_CAN_TX (in), 3V3_CAN_RX (out), 3V3_CAN_MOSI (in), 3V3_CAN_MISO (out), 3V3_CAN_SCLK (in), 3V3_CAN_nCS (in)
USB_DAC_0 = CM6206_PINOUT: USB2_P (bidir), USB2_N (bidir), FR_L (out), FR_R (out), RR_L (out), RR_R (out), SUB (out), MIC (in)
USB_HUB_0 = TUSB4041_PINOUT: USB2_UP_P (bidir), USB2_UP_N (bidir), USB2_DN0_P (bidir), USB2_DN0_N (bidir), USB2_DN1_P (bidir), USB2_DN1_N (bidir), USB2_DN2_P (bidir), USB2_DN2_N (bidir), USB2_DN3_P (bidir), USB2_DN3_N (bidir), 3V3_VBUS_EN (in), 1V1_REG_PWRGD (in)

## Nets
1V1_LAN: sheet REG_3/PWR_OUT
1V1_USB: sheet REG_6/PWR_OUT
1V2_DES_0: sheet REG_4/PWR_OUT
1V8_DES_0: sheet REG_5/PWR_OUT
3V3_AUX: F1.2 F11.2 F12.2 F14.2 F19.2 J18.1 ; sheet REG_2/PWR_OUT
3V3_CAN: F25.2
3V3_DES_0: F12.1 ; sheet GMSL_DESERIALIZER_0/3V3_IN, sheet REG_4/PWR_IN, sheet REG_5/PWR_IN
3V3_GPS: F21.2
3V3_LAN: F19.1 ; sheet REG_3/PWR_IN
3V3_LED: D9.2(A) D9.3(A) J18.2
3V3_M2: F1.1
3V3_MAIN: F21.1 F23.1 F25.1 R160.1 R162.1
3V3_PWR: C119.1 F14.1 R144.1 U17.5(VCC)
3V3_SD: F23.2
3V3_USB: F11.1 ; sheet REG_6/PWR_IN
5V0_CAN: F24.2
5V0_DAC: F8.1
5V0_DISP_0: F10.1 U16.5(VIN)
5V0_DISP_1: F13.1 U18.5(VIN)
5V0_MAIN: F8.2 F9.2 F10.2 F13.2 F16.2 F17.2 F24.1 R154.1 R155.1 ; sheet REG_1/PWR_OUT
5V0_RPI: F9.1
12V0_PoC: C260.1 C261.1 C262.1 C263.1 ; sheet GMSL_DESERIALIZER_0/PoC_PWR, sheet PWR_PROT_0/PWR_OUT
AMP_VCC: J8.1 J8.2 J8.3 J9.1 J9.2 J9.3 ; sheet PWR_SW_0/PWR_OUT
APM_VCC: J3.10 J3.21 J3.33 R147.2 ; sheet OR_1/PWR_IN
CAR_VCC: J3.12 J3.23 J3.35 ; sheet OR_0/PWR_IN
CHASSIS: C120.2 C121.2 C122.2 C123.2 C124.2 C125.2 C126.2 C127.2 C128.2 C129.2 C130.2 C131.2 MH1.1(MH) MH1.2(V1) MH1.3(V2) MH1.4(V3) MH1.5(V4) MH1.6(V5) MH1.7(V6) MH2.1(MH) MH2.2(V1) MH2.3(V2) MH2.4(V3) MH2.5(V4) MH2.6(V5) MH2.7(V6) MH3.1(MH) MH3.2(V1) MH3.3(V2) MH3.4(V3) MH3.5(V4) MH3.6(V5) MH3.7(V6) MH4.1(MH) MH4.2(V1) MH4.3(V2) MH4.4(V3) MH4.5(V4) MH4.6(V5) MH4.7(V6) MH5.1(MH) MH5.2(V1) MH5.3(V2) MH5.4(V3) MH5.5(V4) MH5.6(V5) MH5.7(V6) MH6.1(MH) MH6.2(V1) MH6.3(V2) MH6.4(V3) MH6.5(V4) MH6.6(V5) MH6.7(V6) MH7.1(MH) MH7.2(V1) MH7.3(V2) MH7.4(V3) MH7.5(V4) MH7.6(V5) MH7.7(V6) MH8.1(MH) MH8.2(V1) MH8.3(V2) MH8.4(V3) MH8.5(V4) MH8.6(V5) MH8.7(V6) MH9.1(MH) MH9.2(V1) MH9.3(V2) MH9.4(V3) MH9.5(V4) MH9.6(V5) MH9.7(V6) MH10.1(MH) MH10.2(V1) MH10.3(V2) MH10.4(V3) MH10.5(V4) MH10.6(V5) MH10.7(V6) MH11.1(MH) MH11.2(V1) MH11.3(V2) MH11.4(V3) MH11.5(V4) MH11.6(V5) MH11.7(V6) MH12.1(MH) MH12.2(V1) MH12.3(V2) MH12.4(V3) MH12.5(V4) MH12.6(V5) MH12.7(V6) MH13.1(MH) MH13.2(V1) MH13.3(V2) MH13.4(V3) MH13.5(V4) MH13.6(V5) MH13.7(V6) MH14.1(MH) MH14.2(V1) MH14.3(V2) MH14.4(V3) MH14.5(V4) MH14.6(V5) MH14.7(V6)
FAKRA_GND: C128.1 C129.1 C130.1 C131.1 J16.2(SHIELD)
GND: C119.2 C132.2 C133.2 C260.2 C261.2 C262.2 C263.2 D3.3(GND) D3.8(GND) D20.3(GND) D20.8(GND) D23.3(GND) D23.8(GND) D24.3(GND) D24.8(GND) D26.3(GND) D26.8(GND) D27.3(GND) D27.8(GND) D28.3(GND) D28.8(GND) D29.3(GND) D29.8(GND) D30.3(GND) D30.8(GND) D31.3(GND) D31.8(GND) D32.3(GND) D32.8(GND) J3.9 J3.11 J3.20 J3.22 J3.32 J3.34 J4.2(GND) J4.5(GND) J4.8(GND) J4.11(GND) J4.17(GND) J4.SH1(SHIELD1) J4.SH2(SHIELD2) J4.SH3(SHIELD3) J4.SH4(SHIELD4) J5.4 J5.5(MNT_1) J5.6(MNT_2) J6.2(GND) J6.5(GND) J6.8(GND) J6.11(GND) J6.17(GND) J6.SH1(SHIELD1) J6.SH2(SHIELD2) J6.SH3(SHIELD3) J6.SH4(SHIELD4) J7.4 J7.5(MNT_1) J7.6(MNT_2) J8.4 J8.5 J8.7 J9.4 J9.5 J9.7 J13.3 J13.5(MNT_1) J13.6(MNT_2) J14.3 J14.5(MNT_1) J14.6(MNT_2) J17.A1_B12(GND) J17.B1_A12(GND) J17.SH1(SHIELD) J17.SH2(SHIELD) J17.SH3(SHIELD) J17.SH4(SHIELD) Q12.2(S) R139.1 R145.1 R149.1 R151.1 R158.1 R161.2 R169.2 R170.2 R177.2 U16.2(GND) U17.3(GND) U18.2(GND)
INT_VCC: sheet PWR_SW_0/PWR_IN, sheet PWR_SW_AND_SENSE_0/PWR_OUT, sheet PWR_PROT_0/PWR_IN, sheet PWR_PROT_1/PWR_IN, sheet PWR_PROT_2/PWR_IN
MATENET_GND: C124.1 C125.1 C126.1 C127.1 J15.3(SHIELD)
MINIFAKRA_GND: C120.1 C121.1 C122.1 C123.1 J12.MH1 J12.MH2 J12.MH3 J12.MH4 J12.MH5
PRE_VCC: sheet TCAN1146_0/TCAN_VCC, sheet OR_0/PWR_OUT, sheet OR_1/PWR_OUT, sheet PWR_SW_AND_SENSE_0/PWR_IN
1V1_REG_PWRGD: sheet USB_HUB_0/1V1_REG_PWRGD, sheet REG_6/PWRGD
3V3_3V3_MAIN_T_SENSE: sheet REG_2/3V3_TEMP_SENSE, sheet ADC_1/3V3_IN7
3V3_3V3_MAIN_V_SENSE: sheet REG_2/3V3_V_SENSE, sheet ADC_1/3V3_IN5
3V3_3V3_VCC_I_SENSE: sheet PWR_PROT_2/3V3_I_SENSE, sheet ADC_1/3V3_IN4
3V3_5V0_MAIN_T_SENSE: sheet REG_1/3V3_TEMP_SENSE, sheet ADC_1/3V3_IN0
3V3_5V0_MAIN_V_SENSE: sheet REG_1/3V3_V_SENSE, sheet ADC_1/3V3_IN6
3V3_5V0_VCC_I_SENSE: sheet PWR_PROT_1/3V3_I_SENSE, sheet ADC_1/3V3_IN1
3V3_12V_VCC_I_SENSE: sheet ADC_0/3V3_IN7, sheet PWR_PROT_0/3V3_I_SENSE
3V3_AMP_I_SENSE: sheet ADC_0/3V3_IN1, sheet PWR_SW_0/3V3_I_SENSE
3V3_AMP_PWR_EN: sheet RPI_0/3V3_SPI0_nCS3 (GPIO2), sheet PWR_SW_0/HV_EN
3V3_CAN_RX: sheet MCP2515/3V3_CAN_RX, sheet TCAN1146_0/3V3_CAN_RX
3V3_CAN_TX: sheet MCP2515/3V3_CAN_TX, sheet TCAN1146_0/3V3_CAN_TX
3V3_CAR_APM_I_SENSE: sheet ADC_0/3V3_IN6, sheet OR_1/3V3_IMON
3V3_CAR_APM_V_SENSE: sheet ADC_0/3V3_IN5, sheet OR_1/3V3_V_SENSE
3V3_CAR_VCC_I_SENSE: sheet ADC_0/3V3_IN4, sheet OR_0/3V3_IMON
3V3_CAR_VCC_INH: U17.2(A) ; sheet RPI_0/3V3_GPIO23
3V3_CAR_VCC_nINH: R137.1 U17.4(Y)
3V3_CAR_VCC_V_SENSE: sheet ADC_0/3V3_IN3, sheet OR_0/3V3_V_SENSE
3V3_CPU_FAN_TACHO: R156.2 R160.2 ; sheet RPI_0/3V3_CPU_FAN_TACHO
3V3_I2C0_SCL: sheet RPI_0/3V3_I2C0_SCL, sheet GMSL_DESERIALIZER_0/3V3_SCL, sheet GMSL_DESERIALIZER_0/3V3_SNS_SCL
3V3_I2C0_SDA: sheet RPI_0/3V3_I2C0_SDA, sheet GMSL_DESERIALIZER_0/3V3_SDA, sheet GMSL_DESERIALIZER_0/3V3_SNS_SDA
3V3_INPUT_I_SENSE: sheet ADC_0/3V3_IN2, sheet PWR_SW_AND_SENSE_0/3V3_I_SENSE
3V3_INPUT_V_SENSE: sheet ADC_0/3V3_IN0, sheet PWR_SW_AND_SENSE_0/3V3_V_SENSE
3V3_MAX96724_0_EN_RF_A: sheet GMSL_DESERIALIZER_0/HV_EN_RF_A
3V3_MAX96724_0_EN_RF_B: sheet GMSL_DESERIALIZER_0/HV_EN_RF_B
3V3_MAX96724_0_EN_RF_C: sheet GMSL_DESERIALIZER_0/HV_EN_RF_C
3V3_MAX96724_0_EN_RF_D: sheet GMSL_DESERIALIZER_0/HV_EN_RF_D
3V3_PWM0_CH0 (GPIO12): R159.1 ; sheet RPI_0/3V3_PWM0_CH0 (GPIO12)
3V3_PWM0_CH1 (GPIO13): R157.2 R158.2 R162.2 ; sheet RPI_0/3V3_PWM0_CH1 (GPIO13)
3V3_PWR_nFLT: R178.2 ; sheet PWR_SW_0/3V3_I_nFAULT, sheet OR_0/3V3_nFLT, sheet OR_1/3V3_nFLT, sheet PWR_SW_AND_SENSE_0/n3V3_I_FLT, sheet PWR_PROT_0/n3V3_I_FLT, sheet PWR_PROT_1/n3V3_I_FLT, sheet PWR_PROT_2/n3V3_I_FLT
3V3_SPI0_MISO (GPIO9): sheet RPI_0/3V3_SPI0_MISO (GPIO9), sheet ADC_0/3V3_MISO, sheet ADC_1/3V3_MISO
3V3_SPI0_MOSI (GPIO10): sheet RPI_0/3V3_SPI0_MOSI (GPIO10), sheet ADC_0/3V3_MOSI, sheet ADC_1/3V3_MOSI
3V3_SPI0_nCS0 (GPIO8): sheet RPI_0/3V3_SPI0_nCS0 (GPIO8), sheet ADC_0/3V3_nCS
3V3_SPI0_SCLK (GPIO11): sheet RPI_0/3V3_SPI0_SCLK (GPIO11), sheet ADC_0/3V3_SCLK, sheet ADC_1/3V3_SCLK
3V3_SPI1_MISO (GPIO19): R141.2 ; sheet RPI_0/3V3_SPI1_MISO (GPIO19), sheet MCP2515/3V3_MISO
3V3_SPI1_MOSI (GPIO20): R140.2 ; sheet RPI_0/3V3_SPI1_MOSI (GPIO20), sheet MCP2515/3V3_MOSI
3V3_SPI1_SCLK (GPIO21): R142.2 ; sheet RPI_0/3V3_SPI1_SCLK (GPIO21), sheet MCP2515/3V3_SCLK
3V3_TCAN1146_MISO: R141.1 ; sheet TCAN1146_0/3V3_CAN_MISO
3V3_TCAN1146_MOSI: R140.1 ; sheet TCAN1146_0/3V3_CAN_MOSI
3V3_TCAN1146_nCS: R143.1 ; sheet TCAN1146_0/3V3_CAN_nCS
3V3_TCAN1146_SCLK: R142.1 ; sheet TCAN1146_0/3V3_CAN_SCLK
3V3_VBUS_EN: R138.2 R150.2 ; sheet RPI_0/3V3_VBUS_EN, sheet USB_HUB_0/3V3_VBUS_EN
5V0_HDMI0_CEC: D28.1(IO1) D28.10(NC) J4.13(CEC) ; sheet RPI_0/5V0_HDMI0_CEC
5V0_HDMI0_HOTP: D28.5(IO4) D28.6(NC) J4.19(HOTPLUG) ; sheet RPI_0/5V0_HDMI0_HOTP
5V0_HDMI0_SCL: D28.2(IO2) D28.9(NC) J4.15(SCL) ; sheet RPI_0/5V0_HDMI0_SCL
5V0_HDMI0_SDA: D28.4(IO3) D28.7(NC) J4.16(SDA) ; sheet RPI_0/5V0_HDMI0_SDA
5V0_HDMI1_CEC: D29.1(IO1) D29.10(NC) J6.13(CEC) ; sheet RPI_0/5V0_HDMI1_CEC
5V0_HDMI1_HOTP: D29.5(IO4) D29.6(NC) J6.19(HOTPLUG) ; sheet RPI_0/5V0_HDMI1_HOTP
5V0_HDMI1_SCL: D29.2(IO2) D29.9(NC) J6.15(SCL) ; sheet RPI_0/5V0_HDMI1_SCL
5V0_HDMI1_SDA: D29.4(IO3) D29.7(NC) J6.16(SDA) ; sheet RPI_0/5V0_HDMI1_SDA
AMBIENT_TEMP: R144.2 R145.2 ; sheet ADC_1/3V3_IN2
CAN_N: J3.24 ; sheet TCAN1146_0/CAN_N
CAN_P: J3.25 ; sheet TCAN1146_0/CAN_P
CHA_FAN_PWM: Q12.3(D) R153.2 R155.2
DBG_USB_N: C133.1 D20.4(IO3) D20.7(NC) J17.A7(D-_A) R166.1
DBG_USB_P: C132.1 D20.2(IO2) D20.9(NC) J17.A6(D+_A) R165.1
DISP0_5V: J4.18(5V) J5.1 U16.1(VOUT)
DISP1_5V: J6.18(5V) J7.1 U18.1(VOUT)
FL_N: J3.2 J11.1
FL_P: J3.1 J11.2
FR_N: J3.13 J11.3
FR_P: J3.14 J11.4
HDMI0_CK_N: D26.5(IO4) D26.6(NC) J4.12(CK_N) ; sheet RPI_0/HDMI0_CK_N
HDMI0_CK_P: D26.4(IO3) D26.7(NC) J4.10(CK_P) ; sheet RPI_0/HDMI0_CK_P
HDMI0_D0_N: D26.2(IO2) D26.9(NC) J4.9(D0_N) ; sheet RPI_0/HDMI0_D0_N
HDMI0_D0_P: D26.1(IO1) D26.10(NC) J4.7(D0_P) ; sheet RPI_0/HDMI0_D0_P
HDMI0_D1_N: D3.5(IO4) D3.6(NC) J4.6(D1_N) ; sheet RPI_0/HDMI0_D1_N
HDMI0_D1_P: D3.4(IO3) D3.7(NC) J4.4(D1_P) ; sheet RPI_0/HDMI0_D1_P
HDMI0_D2_N: D3.2(IO2) D3.9(NC) J4.3(D2_N) ; sheet RPI_0/HDMI0_D2_N
HDMI0_D2_P: D3.1(IO1) D3.10(NC) J4.1(D2_P) ; sheet RPI_0/HDMI0_D2_P
HDMI1_CK_N: D27.5(IO4) D27.6(NC) J6.12(CK_N) ; sheet RPI_0/HDMI1_CK_N
HDMI1_CK_P: D27.4(IO3) D27.7(NC) J6.10(CK_P) ; sheet RPI_0/HDMI1_CK_P
HDMI1_D0_N: D27.2(IO2) D27.9(NC) J6.9(D0_N) ; sheet RPI_0/HDMI1_D0_N
HDMI1_D0_P: D27.1(IO1) D27.10(NC) J6.7(D0_P) ; sheet RPI_0/HDMI1_D0_P
HDMI1_D1_N: D23.5(IO4) D23.6(NC) J6.6(D1_N) ; sheet RPI_0/HDMI1_D1_N
HDMI1_D1_P: D23.4(IO3) D23.7(NC) J6.4(D1_P) ; sheet RPI_0/HDMI1_D1_P
HDMI1_D2_N: D23.2(IO2) D23.9(NC) J6.3(D2_N) ; sheet RPI_0/HDMI1_D2_N
HDMI1_D2_P: D23.1(IO1) D23.10(NC) J6.1(D2_P) ; sheet RPI_0/HDMI1_D2_P
HV_CPU_FAN_PWM: R152.2 R154.2 ; sheet RPI_0/HV_CPU_FAN_PWM
HV_PWR_EN: sheet TCAN1146_0/HV_CAN_INH, sheet OR_0/HV_nSLEEP, sheet OR_1/HV_nSLEEP, sheet PWR_SW_AND_SENSE_0/HV_PWR_EN
LL_FR_L: J9.6 ; sheet USB_DAC_0/FR_L
LL_FR_R: J9.8 ; sheet USB_DAC_0/FR_R
LL_RR_L: J8.6 ; sheet USB_DAC_0/RR_L
LL_RR_R: J8.8 ; sheet USB_DAC_0/RR_R
MAX_M10M_RF_IN: D32.1(IO1) D32.10(NC) J16.1(RF) ; sheet GPS_0/RF
MIC_P: J3.27 ; sheet USB_DAC_0/MIC
PRE_RC_DBG_USB_N: R166.2 ; sheet RPI_0/USB2_N
PRE_RC_DBG_USB_P: R165.2 ; sheet RPI_0/USB2_P
RF_A: J12.2 ; sheet GMSL_DESERIALIZER_0/RF_A
RF_B: J12.1 ; sheet GMSL_DESERIALIZER_0/RF_B
RF_C: J12.4 ; sheet GMSL_DESERIALIZER_0/RF_C
RF_D: J12.3 ; sheet GMSL_DESERIALIZER_0/RF_D
RL_N: J3.3 J10.4
RL_P: J3.4 J10.3
RR_N: J3.5 J10.2
RR_P: J3.6 J10.1
SUB_P: J3.28 ; sheet USB_DAC_0/SUB
TRX_CON_N: D24.2(IO2) D24.9(NC) J15.1(TX_P) ; sheet 1000_BASE_T1_PHY/TRX_CON_N
TRX_CON_P: D24.4(IO3) D24.7(NC) J15.2(TX_N) ; sheet 1000_BASE_T1_PHY/TRX_CON_P
USB2_CC1: D20.1(IO1) D20.10(NC) J17.A5(CC1_A) R167.2 R169.1
USB2_CC2: D20.5(IO4) D20.6(NC) J17.B5(CC1_B) R168.2 R170.1
USB2_TYPEA_DISP0_D_N: D30.2(IO2) D30.9(NC) J5.2 ; sheet USB_HUB_0/USB2_DN1_N
USB2_TYPEA_DISP0_D_P: D30.4(IO3) D30.7(NC) J5.3 ; sheet USB_HUB_0/USB2_DN1_P
USB2_TYPEA_DISP1_D_N: D31.2(IO2) D31.9(NC) J7.2 ; sheet USB_HUB_0/USB2_DN0_N
USB2_TYPEA_DISP1_D_P: D31.4(IO3) D31.7(NC) J7.3 ; sheet USB_HUB_0/USB2_DN0_P
NetD9_1: D9.1(K) R177.1
NetD9_4: D9.4(K) R178.1
NetF16_1: F16.1 J13.1
NetF17_1: F17.1 J14.1
NetJ13_2: J13.2 R152.1
NetJ13_4: J13.4 R156.1
NetJ14_2: J14.2 R153.1
NetJ14_4: J14.4 R157.1
NetQ12_1: Q12.1(G) R159.2 R161.1
NetR52_1: R52.1 ; sheet 1000_BASE_T1_PHY/RXD0
NetR52_2: R52.2 ; sheet 1000_BASE_T_PHY/TXD0
NetR53_1: R53.1 ; sheet 1000_BASE_T1_PHY/RXD1
NetR53_2: R53.2 ; sheet 1000_BASE_T_PHY/TXD1
NetR54_1: R54.1 ; sheet 1000_BASE_T1_PHY/RXD2
NetR54_2: R54.2 ; sheet 1000_BASE_T_PHY/TXD2
NetR55_1: R55.1 ; sheet 1000_BASE_T1_PHY/RXD3
NetR55_2: R55.2 ; sheet 1000_BASE_T_PHY/TXD3
NetR137_2: R137.2 ; sheet OR_0/3V3_nINH
NetR138_1: R138.1 R139.2 U16.4(EN)
NetR143_2: R143.2 ; sheet RPI_0/3V3_SPI1_nCS1 (GPIO27)
NetR146_1: R146.1 ; sheet MCP2515/3V3_nINT
NetR146_2: R146.2 ; sheet RPI_0/3V3_SPI1_nCS2 (GPIO16)
NetR147_1: R147.1 R149.2 U17.1(B)
NetR148_1: R148.1 ; sheet MCP2515/3V3_nRST
NetR148_2: R148.2 ; sheet RPI_0/3V3_SPI3_SCLK (GPIO7)
NetR150_1: R150.1 R151.2 U18.4(EN)
NetR163_1: R163.1 ; sheet RPI_0/3V3_UART0_RX (GPIO15)
NetR163_2: R163.2 ; sheet GPS_0/3V3_GPS_TXD
NetR164_1: R164.1 ; sheet RPI_0/3V3_UART0_TX (GPIO14)
NetR164_2: R164.2 ; sheet GPS_0/3V3_GPS_RXD
NetR167_1: R167.1 ; sheet RPI_0/5V0_USB2_CC1
NetR168_1: R168.1 ; sheet RPI_0/5V0_USB2_CC2
NetR269_1: R269.1 ; sheet 1000_BASE_T1_PHY/RXC
NetR269_2: R269.2 ; sheet 1000_BASE_T_PHY/TXC
NetR270_1: R270.1 ; sheet 1000_BASE_T1_PHY/RX_CTL
NetR270_2: R270.2 ; sheet 1000_BASE_T_PHY/TX_CTL
NetR279_1: R279.1 ; sheet 1000_BASE_T1_PHY/TXD0
NetR279_2: R279.2 ; sheet 1000_BASE_T_PHY/RXD0
NetR291_1: R291.1 ; sheet 1000_BASE_T1_PHY/TXD1
NetR291_2: R291.2 ; sheet 1000_BASE_T_PHY/RXD1
NetR292_1: R292.1 ; sheet 1000_BASE_T1_PHY/TXD2
NetR292_2: R292.2 ; sheet 1000_BASE_T_PHY/RXD2
NetR293_1: R293.1 ; sheet 1000_BASE_T1_PHY/TXD3
NetR293_2: R293.2 ; sheet 1000_BASE_T_PHY/RXD3
NetR294_1: R294.1 ; sheet 1000_BASE_T1_PHY/TXC
NetR294_2: R294.2 ; sheet 1000_BASE_T_PHY/RXC
NetR295_1: R295.1 ; sheet 1000_BASE_T1_PHY/TX_CTL
NetR295_2: R295.2 ; sheet 1000_BASE_T_PHY/RX_CTL
(unnamed): sheet USB_DAC_0/USB2_P, sheet USB_HUB_0/USB2_DN2_P
(unnamed): sheet USB_DAC_0/USB2_N, sheet USB_HUB_0/USB2_DN2_N
(unnamed): sheet RPI_0/3V3_PCIE_nCLKREQ, sheet NVME_0/nPCIE_CLKREQ
(unnamed): sheet RPI_0/3V3_PCIE_nWAKE, sheet NVME_0/nPCIE_WAKE
(unnamed): sheet RPI_0/3V3_PCIE_PWR_EN, sheet NVME_0/PCIE_PWR_EN
(unnamed): sheet RPI_0/PCIE_CLK_P, sheet NVME_0/PCIE_CLK_P
(unnamed): sheet RPI_0/PCIE_CLK_N, sheet NVME_0/PCIE_CLK_N
(unnamed): sheet RPI_0/PCIE_RX_P, sheet NVME_0/PCIE_RX0_P
(unnamed): sheet RPI_0/PCIE_RX_N, sheet NVME_0/PCIE_RX0_N
(unnamed): sheet RPI_0/PCIE_TX_P, sheet NVME_0/PCIE_TX0_P
(unnamed): sheet RPI_0/PCIE_TX_N, sheet NVME_0/PCIE_TX0_N
(unnamed): sheet RPI_0/3V3_PCIE_nRST, sheet NVME_0/nPCIE_RST
(unnamed): sheet RPI_0/DPHY0_D0_N, sheet GMSL_DESERIALIZER_0/CSI0_D0_N
(unnamed): sheet RPI_0/DPHY0_D0_P, sheet GMSL_DESERIALIZER_0/CSI0_D0_P
(unnamed): sheet RPI_0/DPHY0_D1_N, sheet GMSL_DESERIALIZER_0/CSI0_D1_N
(unnamed): sheet RPI_0/DPHY0_D1_P, sheet GMSL_DESERIALIZER_0/CSI0_D1_P
(unnamed): sheet RPI_0/DPHY0_CK_N, sheet GMSL_DESERIALIZER_0/CSI0_CK_N
(unnamed): sheet RPI_0/DPHY0_CK_P, sheet GMSL_DESERIALIZER_0/CSI0_CK_P
(unnamed): sheet RPI_0/DPHY0_D2_N, sheet GMSL_DESERIALIZER_0/CSI0_D2_N
(unnamed): sheet RPI_0/DPHY0_D2_P, sheet GMSL_DESERIALIZER_0/CSI0_D2_P
(unnamed): sheet RPI_0/DPHY0_D3_N, sheet GMSL_DESERIALIZER_0/CSI0_D3_N
(unnamed): sheet RPI_0/DPHY0_D3_P, sheet GMSL_DESERIALIZER_0/CSI0_D3_P
(unnamed): sheet RPI_0/DPHY1_D0_N, sheet GMSL_DESERIALIZER_0/CSI1_D0_N
(unnamed): sheet RPI_0/DPHY1_D0_P, sheet GMSL_DESERIALIZER_0/CSI1_D0_P
(unnamed): sheet RPI_0/DPHY1_D1_N, sheet GMSL_DESERIALIZER_0/CSI1_D1_N
(unnamed): sheet RPI_0/DPHY1_D1_P, sheet GMSL_DESERIALIZER_0/CSI1_D1_P
(unnamed): sheet RPI_0/DPHY1_CK_N, sheet GMSL_DESERIALIZER_0/CSI1_CK_N
(unnamed): sheet RPI_0/DPHY1_CK_P, sheet GMSL_DESERIALIZER_0/CSI1_CK_P
(unnamed): sheet RPI_0/DPHY1_D2_N, sheet GMSL_DESERIALIZER_0/CSI1_D2_N
(unnamed): sheet RPI_0/DPHY1_D2_P, sheet GMSL_DESERIALIZER_0/CSI1_D2_P
(unnamed): sheet RPI_0/DPHY1_D3_N, sheet GMSL_DESERIALIZER_0/CSI1_D3_N
(unnamed): sheet RPI_0/DPHY1_D3_P, sheet GMSL_DESERIALIZER_0/CSI1_D3_P
(unnamed): sheet RPI_0/ETH_TRD3_P, sheet 1000_BASE_T_PHY/TXRXD_P
(unnamed): sheet RPI_0/ETH_TRD3_N, sheet 1000_BASE_T_PHY/TXRXD_N
(unnamed): sheet RPI_0/ETH_TRD2_N, sheet 1000_BASE_T_PHY/TXRXC_N
(unnamed): sheet RPI_0/ETH_TRD2_P, sheet 1000_BASE_T_PHY/TXRXC_P
(unnamed): sheet RPI_0/ETH_TRD1_P, sheet 1000_BASE_T_PHY/TXRXB_P
(unnamed): sheet RPI_0/ETH_TRD1_N, sheet 1000_BASE_T_PHY/TXRXB_N
(unnamed): sheet RPI_0/ETH_TRD0_N, sheet 1000_BASE_T_PHY/TXRXA_N
(unnamed): sheet RPI_0/ETH_TRD0_P, sheet 1000_BASE_T_PHY/TXRXA_P
(unnamed): sheet RPI_0/3V3_CAM_GPIO0, sheet GMSL_DESERIALIZER_0/3V3_nPWDN
(unnamed): sheet RPI_0/SD_CLK, sheet SD/SD_CLK
(unnamed): sheet RPI_0/SD_DAT3, sheet SD/SD_DAT3
(unnamed): sheet RPI_0/SD_DAT0, sheet SD/SD_DAT0
(unnamed): sheet RPI_0/SD_DAT1, sheet SD/SD_DAT1
(unnamed): sheet RPI_0/SD_DAT2, sheet SD/SD_DAT2
(unnamed): sheet RPI_0/3V3_SD_PWR_EN, sheet SD/SD_PWR_EN
(unnamed): sheet RPI_0/SD_CMD, sheet SD/SD_CMD
(unnamed): sheet RPI_0/3V3_SPI0_nCS2 (GPIO3), sheet ADC_1/3V3_nCS
(unnamed): sheet RPI_0/USB3_1_D_P, sheet USB_HUB_0/USB2_UP_P
(unnamed): sheet RPI_0/USB3_1_D_N, sheet USB_HUB_0/USB2_UP_N
(unnamed): sheet RPI_0/3V3_SPI1_nCS0 (GPIO18), sheet MCP2515/3V3_nCS
(unnamed): sheet REG_1/PWR_IN, sheet PWR_PROT_1/PWR_OUT
(unnamed): sheet REG_2/PWR_IN, sheet PWR_PROT_2/PWR_OUT
(unnamed): sheet 1000_BASE_T_PHY/RESET_N, sheet 1000_BASE_T1_PHY/RESET_N

Not connected (* = marked no-connect by the designer): D24 1(IO1)* 5(IO4)* 6(NC)* 10(NC)*; D30 1(IO1)* 5(IO4)* 6(NC)* 10(NC)*; D31 1(IO1)* 5(IO4)* 6(NC)* 10(NC)*; D32 2(IO2)* 4(IO3)* 5(IO4)* 6(NC)* 7(NC)* 9(NC)*; J3 7 8 15 16 17 18 19 26 29 30 31; J4 14(UTIL)*; J6 14(UTIL)*; J17 A4_B9(VBUS)* A8(SBU1)* B4_A9(VBUS)* B6(D+_B)* B7(D-_B)* B8(SBU2)*; U16 3(nFLG)*; U18 3(nFLG)*

## Layout directives
net class PWR: 1V1_LAN, 1V1_USB, 1V2_DES_0, 1V8_DES_0, 3V3_AUX, 3V3_CAN, 3V3_DES_0, 3V3_GPS, 3V3_LAN, 3V3_M2, 3V3_PWR, 3V3_SD, 3V3_USB, 5V0_CAN, 5V0_DAC, 5V0_DISP_0, 5V0_DISP_1, 5V0_MAIN, 5V0_RPI, 12V0_PoC, AMP_VCC, CHASSIS, DISP0_5V, DISP1_5V, FAKRA_GND, FL_N, FL_P, FR_N, FR_P, MATENET_GND, MINIFAKRA_GND, NetF16_1, NetF17_1, RL_N, RL_P, RR_N, RR_P
differential pair; differential pair class 90DIFF: DBG_USB_N, DBG_USB_P
net class RGMII_8870_RX: (no net found under the mark)
net class RGMII_8870_TX: (no net found under the mark)
net class RGMII_8830_TX: (no net found under the mark)
net class RGMII_8830_RX: (no net found under the mark)

## Notes on the sheet
- - NEED 4 GPIOS TO ENABLE DISP 0 AND 1, INH CAR PWR, AND ENABLE AMP
  - ANY LEFT OVER GPIOS CAN BE USED FOR FLT PINS OR TO ENABLE GMSL PWR
  - MAYBE REMOVE GMSL PWR TOGGLEABILITY ALLTOGETHER ON THIS BOARD
- DISP0
- HDMI + USB
- HV_PWR_EN PULLED LOW IN PWR_SW_AND_SENSE SCHEMATIC
- 3V3_MAIN COMES FROM RPI
- 35P AMPSEAL
- Used USB2 Type A here since stiffer than a JST and can be used for more than just displays
- (near F14) 3V3_PWR IS FOR POWER SENSE STUFF (CURRENT SENSE ICs AND TEMP SENSE ETC)
- DOUBLE CHECK USB LANE POLARITY
- ACC PWR IS JUST TO TOGGLE WAKE PIN OF TCAN1146
- (near U17) THE PURPOSE OF THIS OPEN-DRAIN SCHMITT-TRIGGER NAND GATE IS TO ENSURE THAT CAR POWER CAN ONLY BE INHIBITED SO LONG AS THE VOLTAGE OF APM POWER IS ABOVE ~8V. OTHERWISE IT MIGHT BE POSSIBLE FOR THIS ECU TO KILL ITSELF BY INHIBITING CAR POWER WHEN NO OTHER POWER SOURCE IS AVAILABLE
  TO INH CAR PWR, 3V3_CAR_VCC_INH NEEDS TO BE HIGH AND APM POWER NEEDS TO BE AVAILABLE
- DISP1
- V_POS IS 2V-2.2V
  V_NEG IS 1.5-.9V
  THIS DIVIDER OUTPUTS 1.5V AT 10V AND .9V AT 6V
- SD CARD EXPOSED BUT UNUSED SINCE USING CM5 WITH eMMC ONBOARD
- SPEAKER OUTPUTS FROM AMPS COME HERE AND GET SENT TO AMPSEAL
- LINE LEVEL AUDIO OUTPUTS TO INTEGRATED AMPS. MIC AND SUB DO NOT HAVE AMPS IN THE HEAD UNIT
- SAME GPIO AS OTHER DISPLAY ENABLE SIGNAL
- NOT USING DN0 PORT FOR CRITICAL STUFF SINCE DS MENTIONS THAT PORT 1 (WHICH I CALLED PORT 0) MIGHT NOT SUPPORT "CDP" IN CERTAIN CONFIGS AND IDRK WTF THAT MEANS
- AMPLIFIER CONNECTORS
- FIGURE OUT AUDIO GROUND SITUATION, DO WE JUST USE GENERIC GND?
- 4P INPUT
- FAKRA
- (near J12) NO ESD PROT ON GMSL2 INPUTS SINCE GMSL2 ICs HAVE INTEGRATED ESD PROT AND PoC WHICH MAKE THE NEED FOR STANDALONE ESD PROT UNLIKELY
- CPU
- CHASSIS
- FAN INTERFACES
- FLIPPED POLARITY OF BASE-T1, BUT PHYS SHOULD BE ABLE TO HANDLE IT
- 1P BIDIR
- H-MTD
- MECH
- ADDED DNP TO MAKE VOLTAGE DIVIDER ON TACH PIN IN CASE RPI MIGHT SEE MORE THAN 3V3 ON THIS PIN. INTERNET SAYS TACH PINS ARE TYPICALLY OD THOUGH SO SHOULD ONLY NEED THE PU TO 3V3_MAIN
- WRONG FAKRA 3D MODEL
- JUMPERS IN CASE I FUCKED UP
- 1P INPUT
- CHECK GPS LED SIGNAL POLARITY
- USB-C
- DBG
- (near R169) THESE ARE PLACEHOLDERS FOR 5.1k BUT SHOULDN'T BE NEEDED
- NOT TAKING VBUS OVER USB C
- USB-A
- 2P GENERIC
- 2 FAN IFs
  CAN SW
  USB SOUND CARD
  2 HDMI + USBs FOR DISPLAYS
  5V REG (5A SHOULD BE ENOUGH)
  AMPS WILL BE EXTERNAL
  ADD ABILITY TO MUTE AMPS SINCE THEY MAKE WEIRD NOISES ON BOOT
- Labels drawn without touching a wire or pin: CHASSIS, MIC_N, MIC_P, SUB_N, SUB_P

## Library data of the parts
C119-C133 = CMP-001-00058-1: LARGE PADS, 0402 CAP, CHANGE COMMENT TO MATCH REAL P/N; Capacitor Type: Ceramic; Min Operating Temperature: -55°C; Mounting Technology: Surface Mount; Pins: 2; Case/Package: 0402; RoHS Compliant: Yes; Max Operating Temperature: 85°C
C260-C263 = CMP-2000-06362-2: CAP CER 47UF 16V X5R 1210; Tolerance: 10%; Material: Ceramic; Case Code (Metric): 3225; RoHS Compliant: Yes; Min Operating Temperature: -55°C; Radiation Hardening: No; Voltage: 16V; Package Quantity: 1; Case Code (Imperial): 1210; REACH SVHC: No SVHC; Capacitance: 47uF; Voltage Rating (DC): 16V; Dielectric: X5R; Case/Package: 1210; Length: 3.2mm; Voltage Rating: 16V; Packaging: Cut Tape; Width: 0.098inch; Number of Pins: 2; Lead Free: Lead Free; Height: 2.5mm; Mount: Surface Mount; Termination: SMD/SMT; Max Operating Temperature: 85°C; Thickness: 0.106inch; Depth: 2.5mm
D3 D20 D23 D24 D26-D32 = CMP-04989-000002-1: 4-CHANNEL LOW-CAPACITANCE SURGE; Manufacturer: Texas Instruments; Value: 0.55pF; Reverse Standoff Voltage: 3.6V; Standoff Height: 0mm; Breakdown Voltage: 5.5V; Peak Pulse Current: 5.5A; Clamping Voltage: 11.5V; Direction: Bidirectional; Peak Pulse Power: 50W; Number Of Channels: 4; Ambient Temperature Range High: +125°C; ComponentLink2Description: Datasheet; Height: 0.55mm; Lead Free: Yes; Device Class L3: unset; Temperature Range High: +125°C; Temperature Range Low: -40°C; Package: DQA0010A; Temperature: -40°C to +125°C; Capacitance: 0.55pF; RoHS: TRUE; Mouser Description: 4-Channel Low-Capacitance Surge and ESD Protection Diode 10-USON -40 to 125; Category: Diode; Device Class L1: Circuit Protection; Octopart: https://octopart.com/esd204dqar-texas+instruments-89917476; Device Class L2: TVS Diodes; Ambient Temperature Range Low: -40°C; Manufacturer Part Number: ESD204DQAR; ComponentLink2URL: http://www.ti.com/lit/ds/symlink/esd204.pdf; Automotive: No; Digikey Description: 4-CHANNEL LOW-CAPACITANCE SURGE
D9 = CMP-004-00040-2: Led, Red/Grn, 180Mcd/230Mcd, 624Nm/525Nm Rohs Compliant: Yes; Source: rgled.SchLib; Component Type: Standard; Pins: 4; Design Item ID: CMP-004-00034-2
F1 F8-F14 F16 F17 F19 = CMP-16042-000006-1: FUSE BOARD MNT 5A 63VAC/VDC 1206; RoHS Compliant: Yes
F21 F23-F25 = CMP-16043-000017-1: PTC RESET FUSE 15V 100MA 0805; Max Current Rating: 100A; Trip Current: 300mA; Time to Trip: 1.5s; Lead Free: Lead Free; Case/Package: 0805; Package Quantity: 1; Hold Current: 100mA; Case Code (Metric): 2012; Packaging: Tape and Reel; Case Code (Imperial): 0805; RoHS Compliant: Yes
J3 = CMP-03369-000154-1: CONN HEADER R/A 35POS 4MM; Primary Type: Rectangular; Circuit Application: Power; Tab Thickness: 1.3mm; Number of Signal Positions: 35; Shielding: Unshielded; Pitch: 0.157inch; Max Voltage Rating (AC): 250V; Connector System: Wire-to-Device; Insulation: Insulated; Current Rating: 17A; PCB Thickness: 0.062inch; PCB Mount Retention: With; Gender: Male; Connector Type: Male Pin; PCB Mount Alignment: Yes (With); Series: Ampseal; Depth: 37.9mm; Orientation: Right Angle; Length: 3.03inch; Termination: Solder; Radiation Hardening: No; Number of Rows: 3; Contact Plating: Tin; Lead Free: Lead Free; Flammability Rating: UL94 V-0; Contact Material: Brass; Number of Contacts: 35; ELV: Compliant; Max Operating Temperature: 221°C; Min Operating Temperature: -40°C; Package Quantity: 1; Mount: Through Hole; Contact Type: Male Pin; Housing Material: Thermoplastic; Number of Positions: 35; Packaging: Bulk; Row Spacing: 0.157inch; RoHS Compliant: Yes; Height: 32.1mm; Color: Black; Fastening Type: Ramp; Sealable: Yes (With); Width: 37.9mm
J4 J6 = CMP-002-00089-4: HDMI CONNECTOR, RCPT, 19POS, SMT; Available until stocks are exhausted Alternative available; Gender: Female; Min Operating Temperature: -20°C; Max Operating Temperature: 85°C; Pins: 19
J5 J7 = CMP-03360-000008-1: CONN RCPT USB2.0 TYPEA 4P SMD RA; Manufacturer: TE Connectivity; Is Female: yes; Current Rating: 1A; Number Of Contacts: 4; Voltage Rating: 30V; Conn Orientation: Right Angle; Shielding: true; Digikey Description: CONN RCPT USB2.0 TYPEA 4P SMD RA; Manufacturer Part Number: 292303-7; Automotive: No; Category: Conn; Temperature: -55°C to +85°C; ComponentLink2Description: Datasheet; Mouser Description: USB Connectors USB A R/A Recpt Assy SMT; Contact Material: Gold,Nickel; Package: 292303-7; Device Class L3: unset; Octopart: https://octopart.com/292303-7-te+connectivity-42840369; RoHS: TRUE; Device Class L2: USB Connectors; ComponentLink2URL: https://www.te.com/usa-en/product-292303-7.html?te_bu=Cor&te_type=other&te_campaign=oct_glo_cor-oct-global-oth-prtnr-fy19-oct-octo-buy-bom_sma-298_2&elqCampaignId=35216; Temperature Range Low: -55°C; Usb Standard: USB 2.0; Temperature Range High: +85°C; Lead Free: Yes; Device Class L1: Connectors
J8 J9 = CMP-17439-000637-1: CONN HEADER VERT 8POS 2.5MM; Voltage Rating: 250V; Mated Stacking Heights: 9.8mm; Number of Positions: 8; Mount: Through Hole; Packaging: Bulk; Pitch: 2.5mm; Insulation Color: Natural; Lead Free: Lead Free; Termination: Press-Fit; Connector Type: Header; Contact Finish - Mating: TIN; Color: Green; Contact Type: Male Pin; Contact Material: Brass; Flammability Rating: UL94 V-0; Fastening Type: Detent; Contact Shape: Square; Series: XH; Insulation Material: Nylon; Number of Rows: 1; Contact Plating: Tin
J10 J11 = CMP-17439-000250-1: CONN HEADER VERT 4POS 2.5MM; Number of Contacts: 4; Contact Resistance: 20mR; Voltage Rating: 250V; Max Current Rating: 3A; Gender: Male; Wire/Cable Gauge: 22AWG; Mated Stacking Heights: 9.8mm; Insulation Resistance: 1GR; Orientation: Straight; Contact Type: Male Pin; Contact Finish - Mating: TIN; Series: XH; Max Voltage Rating (AC): 250V; Lead Pitch: 2.5mm; Contact Shape: Square; Insulation Color: Natural; Termination: Solder; Lead Free: Lead Free; Voltage Rating (AC): 250V; Number of Rows: 1; Flammability Rating: UL94 V-0; Number of Positions: 4; Max Operating Temperature: 85°C; Package Quantity: 500; Mount: Through Hole; REACH SVHC: No SVHC; Connector Type: Header; Insulation Material: Nylon; Fastening Type: Detent; Min Operating Temperature: -25°C; Housing Color: White; Packaging: Bulk; Contact Plating: Tin; Contact Material: Brass; Max Voltage Rating (DC): 250V; Housing Material: Polyamide; Color: Natural; Material: Polyamide; Pitch: 2.5mm; Depth: 5.75mm; Current Rating: 3A; Length: 12.4mm
J12 = CMP-002-00044-4: Connector RF Mini-FAKRA Plug 9GHz 50Ohm Solder Right Angle Through Hole; Source: fakra4ch.SchLib; Component Type: Standard; Pins: 9; Design Item ID: CMP-002-00085-1
J13 J14 = CMP-17439-000370-1: CONN HEADER SMD 4POS 1MM; Voltage Rating: 50V; Number of Positions: 4; Pitch: 0.039inch; Mated Stacking Heights: 4.9mm; Packaging: Cut Tape; Contact Material: Copper Alloy; Lead Free: Lead Free; Contact Type: Male Pin; Fastening Type: Pull; Connector Type: Header; Contact Finish - Mating: TIN; Series: SR; Number of Rows: 1; Contact Shape: Square; Package Quantity: 1; Color: Natural; Flammability Rating: UL94 V-0; Mount: Surface Mount; Insulation Color: Natural; Termination: Solder; Contact Plating: Tin; Insulation Material: Nylon
J15 = CMP-002-00103-2: RF Connector, 2 Contact(s), Male, Panel Mount, Board And Panel Mount, Solder Terminal, Plug; Pins: 2; Min Operating Temperature: -40°C; Max Operating Temperature: 105°C
J16 = CMP-002-00054-2: RF F Connector, Male, Board Mount, Solder Terminal, Plug; Connector Type: RF F CONNECTOR; RoHS Compliant: Yes; Mounting Technology: Board
J17 = CMP-002-00091-1: USB Connector, USB Type C, USB 2.0, Receptacle, 24 Ways, Surface Mount, Through Hole Mount; Pins: 24
J18 = CMP-05178-000003-1: CONN HEADER VERT 2POS 2.54MM; RoHS Compliant: Yes
MH1-MH14 = CMP-00028-00001-11: Plated mounting hole with 6 peripheral vias. This is a generic symbol that groups all relevant footprints.
Q12 = CMP-2000-05968-1: N-Channel Enhancement Mode Mosfet, 50 V, 200 mA, -55 to 150 degC, 6-Pin SOT-323, RoHS, Tape and Reel; Typical Turn-Off Delay Time: 20ns; Number of Channels: 1Channel; Type: EnhancementModeFieldEffectTransistor; Brand: DiodesIncorporated; Vds - Drain-Source Breakdown Voltage: 75V; Vgs - Gate-Source Voltage: 20V; Rds On - Drain-Source Resistance: 1.4Ohms; Transistor Type: 1N-Channel; Configuration: Single; Unit Weight: 0.000212oz; Pd - Power Dissipation: 200mW; Id - Continuous Drain Current: 200mA; Forward Transconductance - Min: 0.1S; Manufacturer URL: http://www.diodes.com/; Series: BSS138; Package Description: 3-Pin Small Outline Transistor, Body 2 x 1.25 mm, Pitch 0.65 mm; Mounting Technology: SurfaceMount; Product Category: MOSFET; RoHS: True; Maximum Operating Temperature: +150C; Height: 1mm; Length: 2.2mm; Technology: Si; Width: 1.35mm; Datasheet URL: http://www.diodes.com/_files/datasheets/ds30206.pdf; Manufacturer: DiodesIncorporated; Package / Case: SOT-323-3; Typical Turn-On Delay Time: 20ns; Transistor Polarity: N-Channel; Factory Pack Quantity: 3000; Packaging: Reel; Product: MOSFETSmallSignal; Datasheet Version: Rev. 11-2, 09/2013; Package Reference: SOT323; Minimum Operating Temperature: -55C; Mounting Style: SMD/SMT; Channel Mode: Enhancement
R52-R55 R137-R139 R144 R147 R149-R162 R165 R166 R169 R170 R177 R178 R269 R270 R279 R291-R295 = CMP-009-00002-14: Resistor
  R52-R55 R269 R270 R279 R291-R295: Value: 33
  R137 R138 R144 R150 R153 R156 R157 R159 R177 R178: Value: 1k
  R139 R147 R151 R154 R155 R160-R162: Value: 100k
  R152: Value: 0
  R158 R169 R170: Value: DNP
  R165 R166: Value: 27
R140-R143 R146 R148 R163 R164 R167 R168 = CMP-009-00118-2: READ THE NAME; Pins: 2; Component Type: Standard; Design Item ID: CMP-009-00206-2; Source: 0402jump.SchLib
R145 = CMP-2000-00869-1: Manufacturer: Panasonic; Part Number: ERT-J1VR103J
U16 U18 = CMP-019-00060-1: SINGLE CHANNEL POWER DISTRIBUTION LOAD SWITCH, -40 to 85°C pF, RoHS; Max Supply Voltage: 5.5V; Min Supply Voltage: 2.7V; Max Operating Temperature: 85°C; Min Operating Temperature: -40°C
U17 = CMP-016-00017-1: Single 2-Input NAND Gate, Schmitt Trigger , Open Drain